# EAGLE schematic Typhoon-Mainboard (EAGLE 7.5.0)

## Sheet 1 of 5: Sheet1
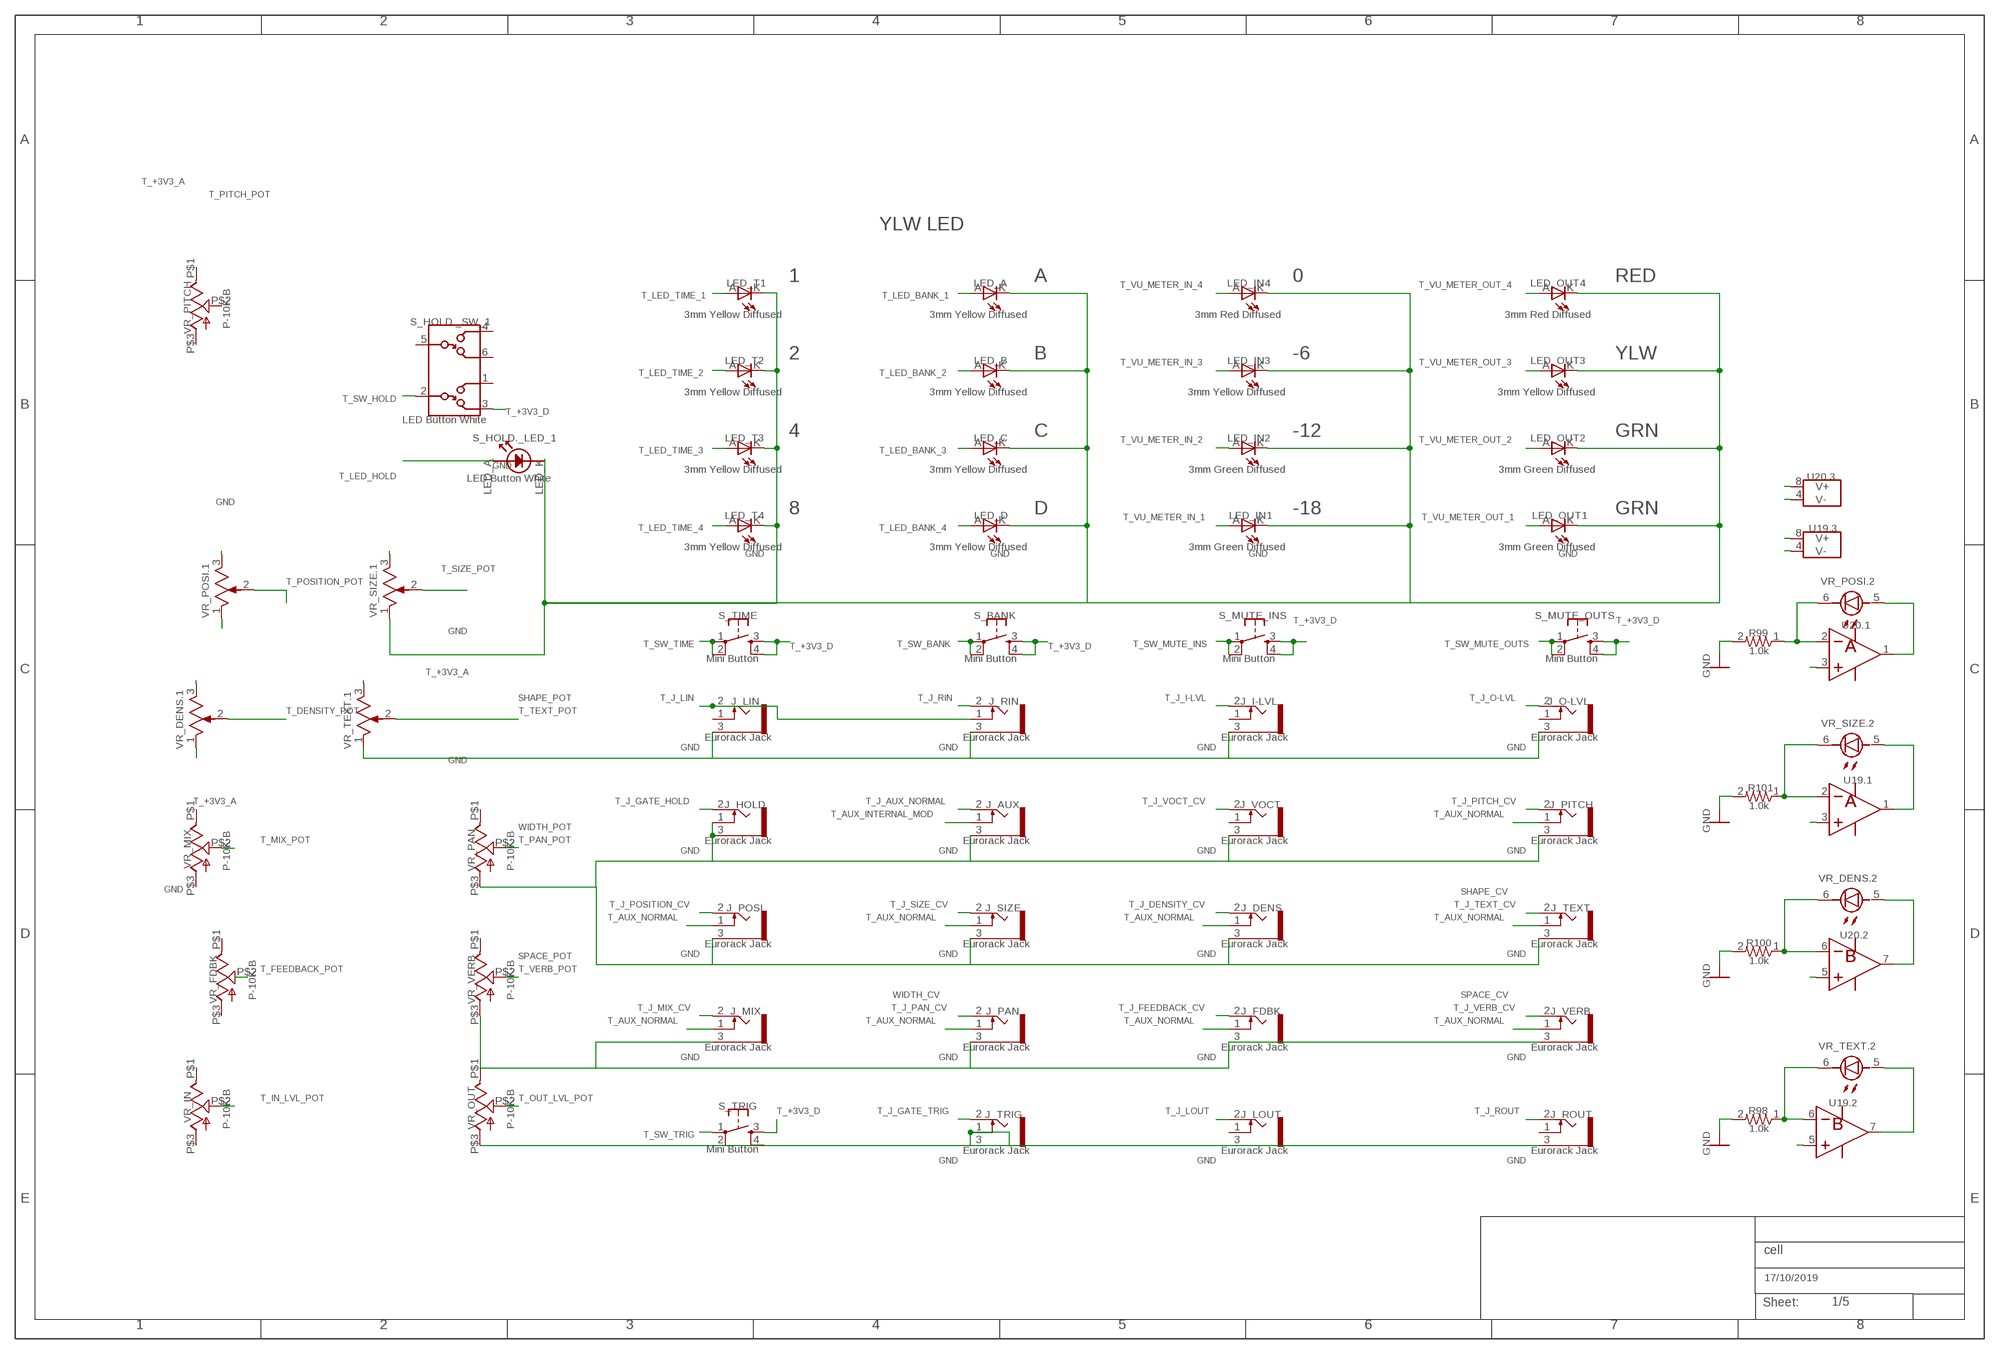
[diagram p0: schematic, sheet 1]

### Parts
J_AUX  Eurorack Jack  EURO_JACKS_SMALL_SILK_(EURO_JACK)  [THONKICONN]
J_DENS  Eurorack Jack  EURO_JACKS_SILK_(EURO_JACK)  [THONKICONN]
J_FDBK  Eurorack Jack  EURO_JACKS_SILK_(EURO_JACK)  [THONKICONN]
J_HOLD  Eurorack Jack  EURO_JACKS_SMALL_SILK_(EURO_JACK)  [THONKICONN]
J_I-LVL  Eurorack Jack  EURO_JACKS_SILK_(EURO_JACK)  [THONKICONN]
J_LIN  Eurorack Jack  EURO_JACKS_SILK_(EURO_JACK)  [THONKICONN]
J_LOUT  Eurorack Jack  EURO_JACKS_SILK_(EURO_JACK)  [THONKICONN]
J_MIX  Eurorack Jack  EURO_JACKS_SILK_(EURO_JACK)  [THONKICONN]
J_O-LVL  Eurorack Jack  EURO_JACKS_SILK_(EURO_JACK)  [THONKICONN]
J_PAN  Eurorack Jack  EURO_JACKS_SILK_(EURO_JACK)  [THONKICONN]
J_PITCH  Eurorack Jack  EURO_JACKS_SILK_(EURO_JACK)  [THONKICONN]
J_POSI  Eurorack Jack  EURO_JACKS_SILK_(EURO_JACK)  [THONKICONN]
J_RIN  Eurorack Jack  EURO_JACKS_SILK_(EURO_JACK)  [THONKICONN]
J_ROUT  Eurorack Jack  EURO_JACKS_SILK_(EURO_JACK)  [THONKICONN]
J_SIZE  Eurorack Jack  EURO_JACKS_SILK_(EURO_JACK)  [THONKICONN]
J_TEXT  Eurorack Jack  EURO_JACKS_SILK_(EURO_JACK)  [THONKICONN]
J_TRIG  Eurorack Jack  EURO_JACKS_SMALL_SILK_(EURO_JACK)  [THONKICONN]
J_VERB  Eurorack Jack  EURO_JACKS_SILK_(EURO_JACK)  [THONKICONN]
J_VOCT  Eurorack Jack  EURO_JACKS_SILK_(EURO_JACK)  [THONKICONN]
LED_A  3mm Yellow Diffused  LED_SILK_(LED)  [LED_SILK]
LED_B  3mm Yellow Diffused  LED_SILK_(LED)  [LED_SILK]
LED_C  3mm Yellow Diffused  LED_SILK_(LED)  [LED_SILK]
LED_D  3mm Yellow Diffused  LED_SILK_(LED)  [LED_SILK]
LED_IN1  3mm Green Diffused  LED_SILK_(LED)  [LED_SILK]
LED_IN2  3mm Green Diffused  LED_SILK_(LED)  [LED_SILK]
LED_IN3  3mm Yellow Diffused  LED_SILK_(LED)  [LED_SILK]
LED_IN4  3mm Red Diffused  LED_SILK_(LED)  [LED_SILK]
LED_OUT1  3mm Green Diffused  LED_SILK_(LED)  [LED_SILK]
LED_OUT2  3mm Green Diffused  LED_SILK_(LED)  [LED_SILK]
LED_OUT3  3mm Yellow Diffused  LED_SILK_(LED)  [LED_SILK]
LED_OUT4  3mm Red Diffused  LED_SILK_(LED)  [LED_SILK]
LED_T1  3mm Yellow Diffused  LED_SILK_(LED)  [LED_SILK]
LED_T2  3mm Yellow Diffused  LED_SILK_(LED)  [LED_SILK]
LED_T3  3mm Yellow Diffused  LED_SILK_(LED)  [LED_SILK]
LED_T4  3mm Yellow Diffused  LED_SILK_(LED)  [LED_SILK]
R98  1.0k  R-US_R0402_(R-US_)  [RES_0603]
R99  1.0k  R-US_R0402_(R-US_)  [RES_0603]
R100  1.0k  R-US_R0402_(R-US_)  [RES_0603]
R101  1.0k  R-US_R0402_(R-US_)  [RES_0603]
S_BANK  Mini Button  TAC_SWITCHTACTILE_PTH_SILK_(TAC_SWITCH)  [TACTILE-PTH_SILK]
S_HOLD  LED Button White  LED_BUTTONLED_BUTTON_SILK_(LED_BUTTON)  [LED_BUTTON_SILK]
S_MUTE_INS  Mini Button  TAC_SWITCHTACTILE_PTH_SILK_(TAC_SWITCH)  [TACTILE-PTH_SILK]
S_MUTE_OUTS  Mini Button  TAC_SWITCHTACTILE_PTH_SILK_(TAC_SWITCH)  [TACTILE-PTH_SILK]
S_TIME  Mini Button  TAC_SWITCHTACTILE_PTH_SILK_(TAC_SWITCH)  [TACTILE-PTH_SILK]
S_TRIG  Mini Button  TAC_SWITCHTACTILE_PTH_SILK_(TAC_SWITCH)  [TACTILE-PTH_SILK]
U19  TLV2172  [TSSOP-8]
U20  TLV2172  [TSSOP-8]
VR_DENS  BOURNS_PTL_LED_SLIDE_POT  [BOURNS_PTL_30MM]
VR_FDBK  P-10K-B  POT_9MM_SNAP-IN___(POT_9MM_SNAP-IN_)  [ALPS_POT_VERTICAL_PS]
VR_IN  P-10K-B  POT_9MM_SNAP-IN___(POT_9MM_SNAP-IN_)  [ALPS_POT_VERTICAL_PS]
VR_MIX  P-10K-B  POT_9MM_SNAP-IN___(POT_9MM_SNAP-IN_)  [ALPS_POT_VERTICAL_PS]
VR_OUT  P-10K-B  POT_9MM_SNAP-IN___(POT_9MM_SNAP-IN_)  [ALPS_POT_VERTICAL_PS]
VR_PAN  P-10K-B  POT_9MM_SNAP-IN___(POT_9MM_SNAP-IN_)  [ALPS_POT_VERTICAL_PS]
VR_PITCH  P-10K-B  POT_9MM_SNAP-IN___(POT_9MM_SNAP-IN_)  [ALPS_POT_VERTICAL_PS]
VR_POSI  BOURNS_PTL_LED_SLIDE_POT  [BOURNS_PTL_30MM]
VR_SIZE  BOURNS_PTL_LED_SLIDE_POT  [BOURNS_PTL_30MM]
VR_TEXT  BOURNS_PTL_LED_SLIDE_POT  [BOURNS_PTL_30MM]
VR_VERB  P-10K-B  POT_9MM_SNAP-IN___(POT_9MM_SNAP-IN_)  [ALPS_POT_VERTICAL_PS]

### Nets
+12V [power]: U19.8(PART_3:V+) U20.8(PART_3:V+) ; also sheet 2,3,4
-12V [power]: U19.4(PART_3:V-) U20.4(PART_3:V-) ; also sheet 2,3,4
GND: J_AUX.3(GND) J_DENS.3(GND) J_FDBK.3(GND) J_HOLD.1(NORM) J_HOLD.3(GND) J_I-LVL.3(GND) J_LIN.3(GND) J_LOUT.3(GND) J_MIX.3(GND) J_O-LVL.3(GND) J_PAN.3(GND) J_PITCH.3(GND) J_POSI.3(GND) J_RIN.3(GND) J_ROUT.3(GND) J_SIZE.3(GND) J_TEXT.3(GND) J_TRIG.1(NORM) J_TRIG.3(GND) J_VERB.3(GND) J_VOCT.3(GND) LED_A.K(C) LED_B.K(C) LED_C.K(C) LED_D.K(C) LED_IN1.K(C) LED_IN2.K(C) LED_IN3.K(C) LED_IN4.K(C) LED_OUT1.K(C) LED_OUT2.K(C) LED_OUT3.K(C) LED_OUT4.K(C) LED_T1.K(C) LED_T2.K(C) LED_T3.K(C) LED_T4.K(C) R98.2 R99.2 R100.2 R101.2 S_HOLD.LED_K(PART__LED_1:LED_K) VR_DENS.1(PART_1:CCW) VR_FDBK.P$3 VR_IN.P$3 VR_MIX.P$3 VR_OUT.P$3 VR_PAN.P$3 VR_PITCH.P$3 VR_POSI.1(PART_1:CCW) VR_SIZE.1(PART_1:CCW) VR_TEXT.1(PART_1:CCW) VR_VERB.P$3 ; supply symbol labelled GND_7 ; also sheet 2,3,4,5
Net_1: R99.1 U20.2(PART_1:IN-) VR_POSI.6(PART_2:gnd)
Net_109: R101.1 U19.2(PART_1:IN-) VR_SIZE.6(PART_2:gnd)
Net_110: R100.1 U20.6(PART_2:IN-) VR_DENS.6(PART_2:gnd)
Net_116: R98.1 U19.6(PART_2:IN-) VR_TEXT.6(PART_2:gnd)
Net_177: U20.1(PART_1:OUT) VR_POSI.5(PART_2:gnd)
Net_178: U19.1(PART_1:OUT) VR_SIZE.5(PART_2:gnd)
Net_182: U20.7(PART_2:OUT) VR_DENS.5(PART_2:gnd)
Net_183: U19.7(PART_2:OUT) VR_TEXT.5(PART_2:gnd)
T_+3V3_A [power]: VR_DENS.3(PART_1:CW) VR_FDBK.P$1 VR_MIX.P$1 VR_PAN.P$1 VR_PITCH.P$1 VR_POSI.3(PART_1:CW) VR_SIZE.3(PART_1:CW) VR_TEXT.3(PART_1:CW) VR_VERB.P$1 ; also sheet 2,4,5
T_+3V3_D [power]: S_BANK.3 S_BANK.4 S_HOLD.3 S_MUTE_INS.3 S_MUTE_INS.4 S_MUTE_OUTS.3 S_MUTE_OUTS.4 S_TIME.3 S_TIME.4 S_TRIG.3 ; also sheet 2,4,5
T_+10V: VR_IN.P$1 VR_OUT.P$1 ; also sheet 2
T_AUX_INTERNAL_MOD: J_AUX.1(NORM) ; also sheet 4
T_AUX_NORMAL: J_DENS.1(NORM) J_FDBK.1(NORM) J_MIX.1(NORM) J_PAN.1(NORM) J_PITCH.1(NORM) J_POSI.1(NORM) J_SIZE.1(NORM) J_TEXT.1(NORM) J_VERB.1(NORM) ; also sheet 4
T_DENSITY_POT: VR_DENS.2(PART_1:W) ; also sheet 5
T_FEEDBACK_POT: VR_FDBK.P$2 ; also sheet 5
T_IN_LVL_POT: VR_IN.P$2 ; also sheet 3
T_J_AUX_NORMAL: J_AUX.2(TIP) ; also sheet 4
T_J_DENSITY_CV: J_DENS.2(TIP) U20.5(PART_2:IN+) ; also sheet 4
T_J_FEEDBACK_CV: J_FDBK.2(TIP) ; also sheet 4
T_J_GATE_HOLD: J_HOLD.2(TIP) ; also sheet 4
T_J_GATE_TRIG: J_TRIG.2(TIP) ; also sheet 4
T_J_I-LVL: J_I-LVL.2(TIP) ; also sheet 3
T_J_LIN: J_LIN.2(TIP) J_RIN.1(NORM) ; also sheet 3
T_J_LOUT: J_LOUT.2(TIP) ; also sheet 3
T_J_MIX_CV: J_MIX.2(TIP) ; also sheet 4
T_J_O-LVL: J_O-LVL.2(TIP) ; also sheet 3
T_J_PAN_CV: J_PAN.2(TIP) ; also sheet 4
T_J_PITCH_CV: J_PITCH.2(TIP) ; also sheet 4
T_J_POSITION_CV: J_POSI.2(TIP) U20.3(PART_1:IN+) ; also sheet 4
T_J_RIN: J_RIN.2(TIP) ; also sheet 3
T_J_ROUT: J_ROUT.2(TIP) ; also sheet 3
T_J_SIZE_CV: J_SIZE.2(TIP) U19.3(PART_1:IN+) ; also sheet 4
T_J_TEXT_CV: J_TEXT.2(TIP) U19.5(PART_2:IN+) ; also sheet 4
T_J_VERB_CV: J_VERB.2(TIP) ; also sheet 4
T_J_VOCT_CV: J_VOCT.2(TIP) ; also sheet 4
T_LED_BANK_1: LED_A.A ; also sheet 5
T_LED_BANK_2: LED_B.A ; also sheet 5
T_LED_BANK_3: LED_C.A ; also sheet 5
T_LED_BANK_4: LED_D.A ; also sheet 5
T_LED_HOLD: S_HOLD.LED_A(PART__LED_1:LED_A) ; also sheet 5
T_LED_TIME_1: LED_T1.A ; also sheet 5
T_LED_TIME_2: LED_T2.A ; also sheet 5
T_LED_TIME_3: LED_T3.A ; also sheet 5
T_LED_TIME_4: LED_T4.A ; also sheet 5
T_MIX_POT: VR_MIX.P$2 ; also sheet 5
T_OUT_LVL_POT: VR_OUT.P$2 ; also sheet 3
T_PAN_POT: VR_PAN.P$2 ; also sheet 5
T_PITCH_POT: VR_PITCH.P$2 ; also sheet 5
T_POSITION_POT: VR_POSI.2(PART_1:W) ; also sheet 5
T_SIZE_POT: VR_SIZE.2(PART_1:W) ; also sheet 5
T_SW_BANK: S_BANK.1 S_BANK.2 ; also sheet 5
T_SW_HOLD: S_HOLD.2 ; also sheet 5
T_SW_MUTE_INS: S_MUTE_INS.1 S_MUTE_INS.2 ; also sheet 5
T_SW_MUTE_OUTS: S_MUTE_OUTS.1 S_MUTE_OUTS.2 ; also sheet 5
T_SW_TIME [power]: S_TIME.1 S_TIME.2 ; also sheet 5
T_SW_TRIG: S_TRIG.1 ; also sheet 5
T_TEXT_POT: VR_TEXT.2(PART_1:W) ; also sheet 5
T_VERB_POT: VR_VERB.P$2 ; also sheet 5
T_VU_METER_IN_1: LED_IN1.A ; also sheet 5
T_VU_METER_IN_2: LED_IN2.A ; also sheet 5
T_VU_METER_IN_3: LED_IN3.A ; also sheet 5
T_VU_METER_IN_4: LED_IN4.A ; also sheet 5
T_VU_METER_OUT_1: LED_OUT1.A ; also sheet 5
T_VU_METER_OUT_2: LED_OUT2.A ; also sheet 5
T_VU_METER_OUT_3: LED_OUT3.A ; also sheet 5
T_VU_METER_OUT_4: LED_OUT4.A ; also sheet 5
Unconnected: J_I-LVL.1(NORM) J_LIN.1(NORM) J_LOUT.1(NORM) J_O-LVL.1(NORM) J_ROUT.1(NORM) J_VOCT.1(NORM) S_HOLD.1 S_HOLD.4 S_HOLD.5 S_HOLD.6 S_TRIG.2 S_TRIG.4

### Notes on the sheet
- 1 | 2 | 3 | 4 | 5 | 6 | 7 | 8
- A | A
- T_+3V3_A
- T_PITCH_POT
- YLW LED
- 1 | A | 0 | RED
- T_VU_METER_IN_4 | T_VU_METER_OUT_4
- LED_T1 | LED_A | LED_IN4 | LED_OUT4
- T_LED_TIME_1 | T_LED_BANK_1
- 3mm Yellow Diffused | 3mm Yellow Diffused | 3mm Red Diffused | 3mm Red Diffused
- S_HOLD._SW_1
- P-10K-B
- VR_PITCH
- 2 | B | -6 | YLW
- T_VU_METER_IN_3 | T_VU_METER_OUT_3
- LED_T2 | LED_B | LED_IN3 | LED_OUT3
- T_LED_TIME_2 | T_LED_BANK_2
- 3mm Yellow Diffused | 3mm Yellow Diffused | 3mm Yellow Diffused | 3mm Yellow Diffused
- T_SW_HOLD
- B | B
- T_+3V3_D
- LED Button White
- 4 | C | -12 | GRN
- T_VU_METER_IN_2 | T_VU_METER_OUT_2
- S_HOLD._LED_1 | LED_T3 | LED_C | LED_IN2 | LED_OUT2
- T_LED_TIME_3 | T_LED_BANK_3
- GND
- 3mm Yellow Diffused | 3mm Yellow Diffused | 3mm Green Diffused | 3mm Green Diffused
- T_LED_HOLD | LED Button White
- U20.3
- GND | 8 | D | -18 | GRN
- T_VU_METER_IN_1 | T_VU_METER_OUT_1
- LED_T4 | LED_D | LED_IN1 | LED_OUT1
- T_LED_TIME_4 | T_LED_BANK_4
- U19.3
- 3mm Yellow Diffused | 3mm Yellow Diffused | 3mm Green Diffused | 3mm Green Diffused
- GND | GND | GND | GND
- T_SIZE_POT
- T_POSITION_POT
- VR_POSI.2
- VR_POSI.1 | VR_SIZE.1 | S_TIME | S_BANK | S_MUTE_INS | T_+3V3_D | S_MUTE_OUTS | T_+3V3_D
- GND | U20.1
- R99
- T_SW_TIME | T_SW_BANK | T_SW_MUTE_INS | T_SW_MUTE_OUTS | A
- T_+3V3_D | T_+3V3_D
- 1.0k
- Mini Button | Mini Button | Mini Button | Mini Button
- C | C
- T_+3V3_A
- GND
- SHAPE_POT | T_J_LIN | T_J_RIN | T_J_I-LVL | T_J_O-LVL
- J_LIN | J_RIN | J_I-LVL | J_O-LVL
- T_DENSITY_POT | T_TEXT_POT
- VR_SIZE.2
- Eurorack Jack | Eurorack Jack | Eurorack Jack | Eurorack Jack
- GND | GND | GND | GND
- VR_DENS.1 | VR_TEXT.1
- GND
- U19.1
- R101
- A
- T_+3V3_A | T_J_GATE_HOLD | T_J_AUX_NORMAL | T_J_VOCT_CV | T_J_PITCH_CV
- 1.0k
- J_HOLD | J_AUX | J_VOCT | J_PITCH
- T_AUX_INTERNAL_MOD | T_AUX_NORMAL
- WIDTH_POT
- GND
- T_MIX_POT | T_PAN_POT | Eurorack Jack | Eurorack Jack | Eurorack Jack | Eurorack Jack
- GND | GND | GND | GND
- VR_MIX | P-10K-B | VR_PAN | P-10K-B
- VR_DENS.2
- GND | SHAPE_CV
- T_J_POSITION_CV | T_J_SIZE_CV | T_J_DENSITY_CV | T_J_TEXT_CV
- J_POSI | J_SIZE | J_DENS | J_TEXT
- T_AUX_NORMAL | T_AUX_NORMAL | T_AUX_NORMAL | T_AUX_NORMAL
- D | D
- Eurorack Jack | Eurorack Jack | Eurorack Jack | Eurorack Jack | U20.2
- R100
- GND | GND | GND | GND | B
- SPACE_POT
- 1.0k
- T_FEEDBACK_POT | T_VERB_POT
- GND
- WIDTH_CV | SPACE_CV
- P-10K-B | P-10K-B
- VR_FDBK | VR_VERB | T_J_MIX_CV | T_J_PAN_CV | T_J_FEEDBACK_CV | T_J_VERB_CV
- J_MIX | J_PAN | J_FDBK | J_VERB
- T_AUX_NORMAL | T_AUX_NORMAL | T_AUX_NORMAL | T_AUX_NORMAL
- Eurorack Jack | Eurorack Jack | Eurorack Jack | Eurorack Jack
- VR_TEXT.2
- GND | GND | GND | GND
- T_IN_LVL_POT | T_OUT_LVL_POT
- T_+3V3_D | T_J_GATE_TRIG | T_J_LOUT | T_J_ROUT | U19.2
- S_TRIG
- R98
- J_TRIG | J_LOUT | J_ROUT | B
- VR_IN | 1.0k
- P-10K-B | VR_OUT | P-10K-B
- T_SW_TRIG
- Mini Button | Eurorack Jack | Eurorack Jack | Eurorack Jack
- GND | GND | GND | GND
- E | E
- cell
- 17/10/2019
- Sheet: | 1/5
- 1 | 2 | 3 | 4 | 5 | 6 | 7 | 8

## Sheet 2 of 5: Sheet2
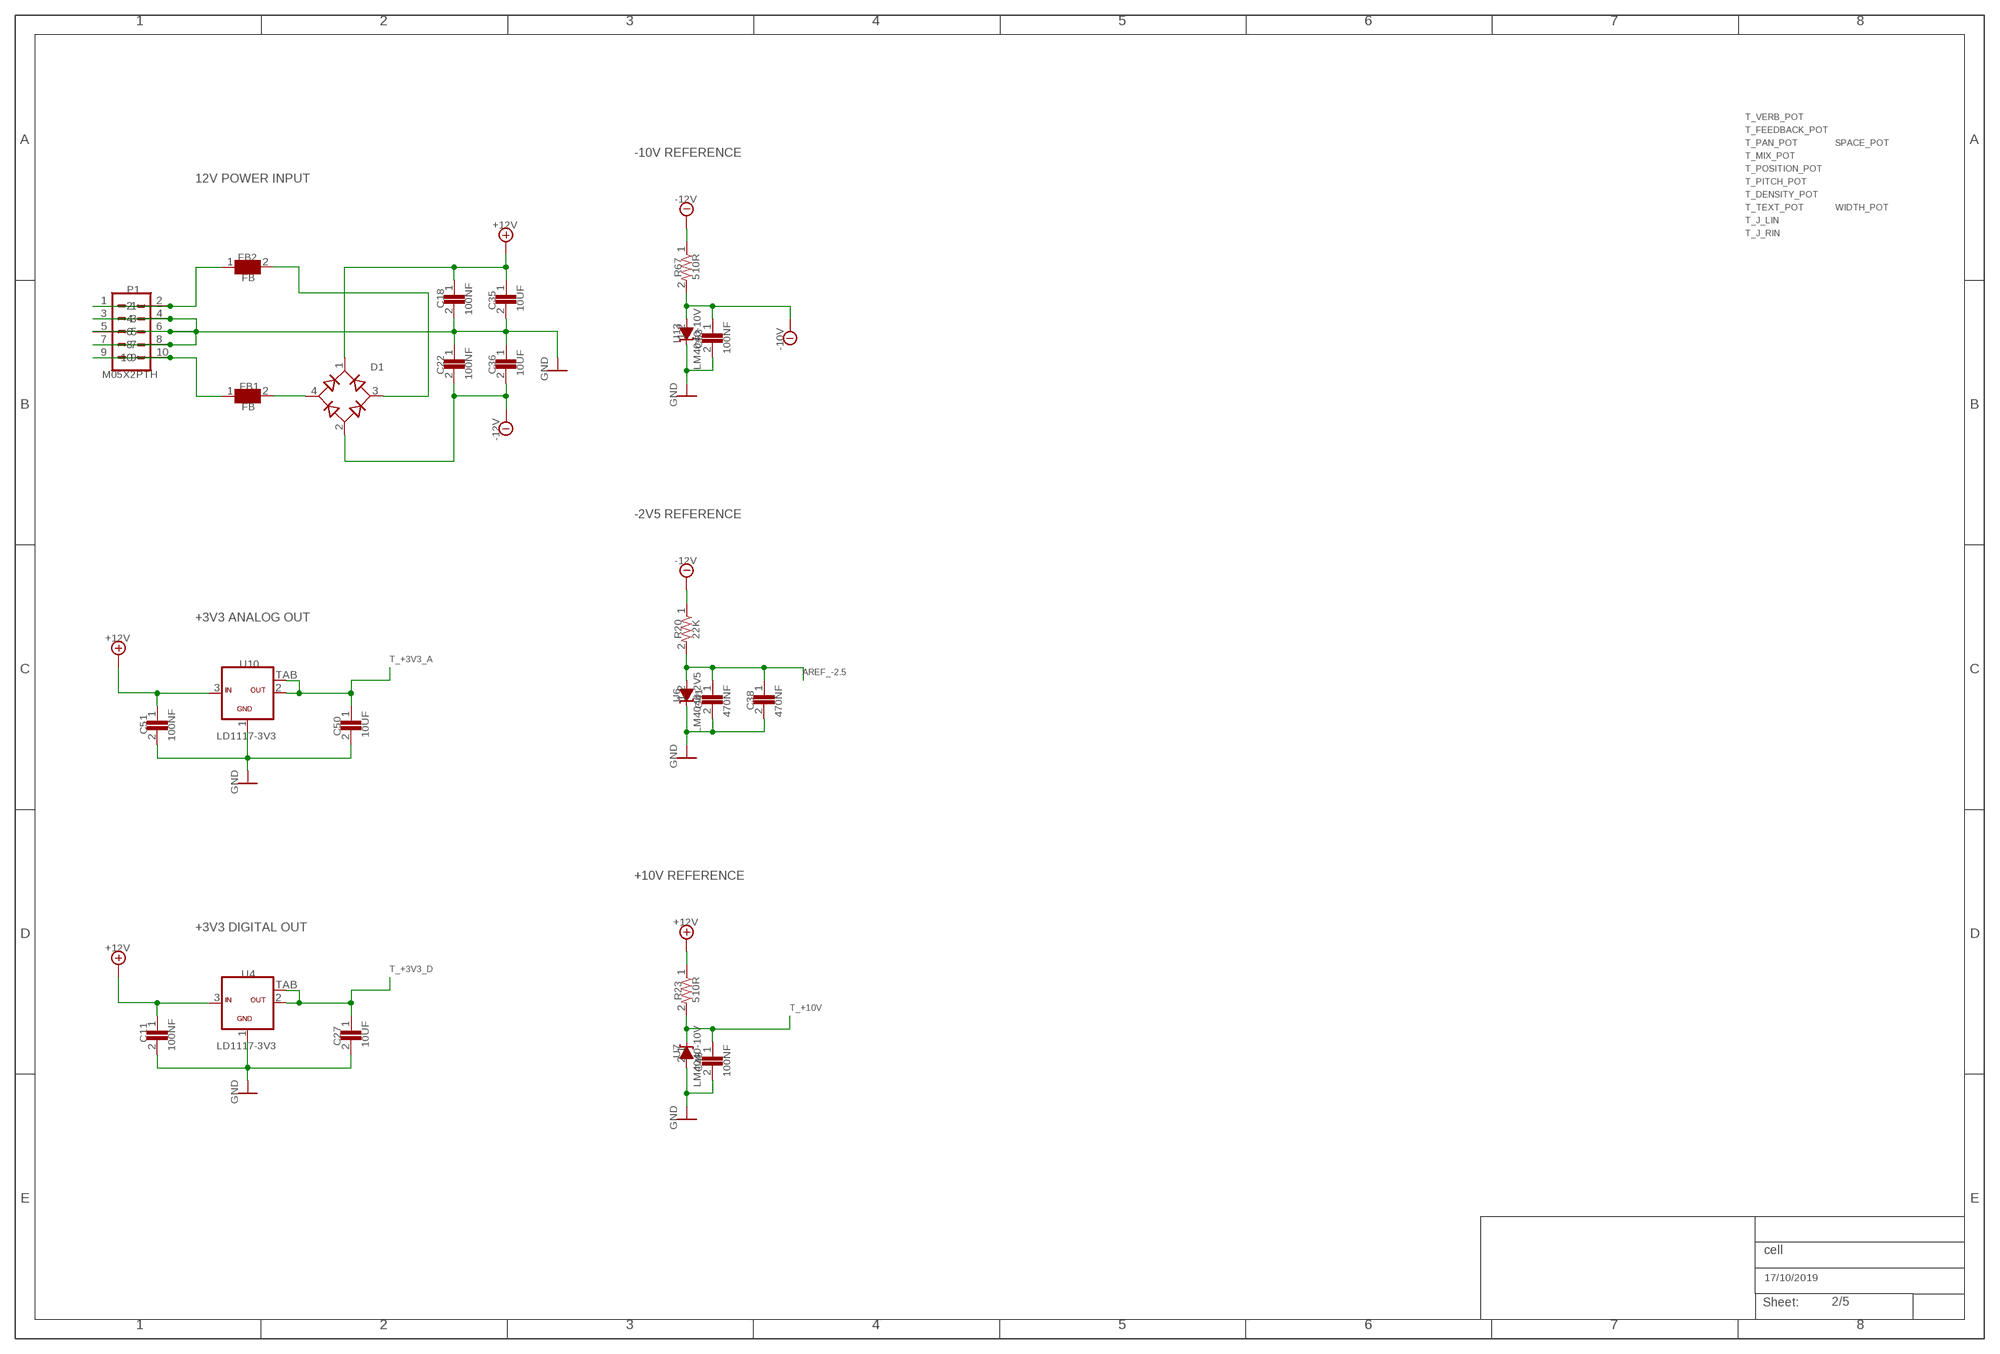
[diagram p1: schematic, sheet 2]

### Parts
C11  100NF  C-EUC0603_(C-EU)  [CAP_0603]
C18  100NF  C-EUC0603_(C-EU)  [CAP_0603]
C22  100NF  C-EUC0603_(C-EU)  [CAP_0603]
C27  10UF  C-EUC0805_(C-EU)  [C0805]
C35  10UF  C-EUC0805_(C-EU)  [C0805]
C36  10UF  C-EUC0805_(C-EU)  [C0805]
C38  470NF  C-EUC0603_(C-EU)  [CAP_0603]
C41  470NF  C-EUC0603_(C-EU)  [CAP_0603]
C48  100NF  C-EUC0603_(C-EU)  [CAP_0603]
C50  10UF  C-EUC0805_(C-EU)  [C0805]
C51  100NF  C-EUC0603_(C-EU)  [CAP_0603]
C63  100NF  C-EUC0603_(C-EU)  [CAP_0603]
D1  MB1S  [SOP-4/6.5X2.54]
FB1  FB  FERRITE_BEAD_0603_(FERRITE_BEAD)  [WUERTH-ELEKTRONIK_0603]
FB2  FB  FERRITE_BEAD_0603_(FERRITE_BEAD)  [WUERTH-ELEKTRONIK_0603]
P1  M05X2PTH  [AVR_ICSP]
R20  22K  R-US_R0603_(R-US_)  [RES_0603]
R23  510R  R-US_R0603_(R-US_)  [RES_0603]
R67  510R  R-US_R0603_(R-US_)  [RES_0603]
U4  LD1117-3V3  LD1117-3V3_(LD1117)  [SOT223]
U6  LM4040-2V5  LM4041DBZA12_(LM4041)  [DBZ_R-PDSO-G3]
U7  LM4040-10V  LM4041DBZA12_(LM4041)_14  [DBZ_R-PDSO-G3]
U10  LD1117-3V3  LD1117-3V3_(LD1117)  [SOT223]
U13  LM4040-10V  LM4041DBZA12_(LM4041)  [DBZ_R-PDSO-G3]

### Nets
+12V [power]: C11.1 C18.1 C35.1 C51.1 D1.1(+) R23.1 U4.3(IN) U10.3(IN) ; also sheet 1,3,4
-10V: C63.1 R67.2 U13.2(A) ; supply symbol labelled -10V_28 ; also sheet 4
-12V [power]: C22.2 C36.2 D1.2(-) R20.1 R67.1 ; supply symbol labelled -12V_11 ; also sheet 1,3,4
AREF_-2.5: C38.1 C41.1 R20.2 U6.2(A) ; also sheet 3
GND: C11.2 C18.2 C22.1 C27.2 C35.2 C36.1 C38.2 C41.2 C48.2 C50.2 C51.2 C63.2 P1.3 P1.4 P1.5 P1.6 P1.7 P1.8 U4.1(GND) U6.1(C) U7.2(A) U10.1(GND) U13.1(C) ; supply symbol labelled GND_7 ; also sheet 1,3,4,5
N$2 [power]: FB2.1 P1.1 P1.2
N$6: FB1.1 P1.9 P1.10
Net_38 [power]: D1.4(AC1) FB1.2
Net_40 [power]: D1.3(AC2) FB2.2
T_+3V3_A [power]: C50.1 U10.2(OUT) U10.TAB(OUT1) ; also sheet 1,4,5
T_+3V3_D [power]: C27.1 U4.2(OUT) U4.TAB(OUT1) ; also sheet 1,4,5
T_+10V: C48.1 R23.2 U7.1(C) ; also sheet 1

### Notes on the sheet
- 1 | 2 | 3 | 4 | 5 | 6 | 7 | 8
- T_VERB_POT
- T_FEEDBACK_POT
- A | A
- T_PAN_POT | SPACE_POT
- -10V REFERENCE
- T_MIX_POT
- T_POSITION_POT
- 12V POWER INPUT
- T_PITCH_POT
- T_DENSITY_POT
- -12V | T_TEXT_POT | WIDTH_POT
- T_J_LIN
- +12V | T_J_RIN
- FB2
- FB
- R67 | 510R
- P1
- C18 | C35
- 10UF
- 100NF
- U13
- C63 | -10V
- 100NF
- M05X2PTH | D1 | LM4040-10V
- C22 | C36 | 10UF
- 100NF | GND
- FB1
- B | B
- FB
- GND
- -12V
- -2V5 REFERENCE
- -12V
- +3V3 ANALOG OUT
- +12V | R20 | 22K
- T_+3V3_A
- C | C
- U10 | AREF_-2.5
- IN | OUT
- U6
- GND
- C41 | C38
- 470NF | 470NF
- C51 | LD1117-3V3 | LM4040-2V5
- C50 | 10UF
- 100NF
- GND
- GND
- +10V REFERENCE
- +3V3 DIGITAL OUT | +12V
- D | D
- +12V
- T_+3V3_D
- U4
- IN | OUT
- R23 | 510R
- T_+10V
- GND
- C11 | LD1117-3V3
- C27 | 10UF
- 100NF
- U7
- C48
- 100NF
- LM4040-10V
- GND
- GND
- E | E
- cell
- 17/10/2019
- Sheet: | 2/5
- 1 | 2 | 3 | 4 | 5 | 6 | 7 | 8

## Sheet 3 of 5: Sheet3
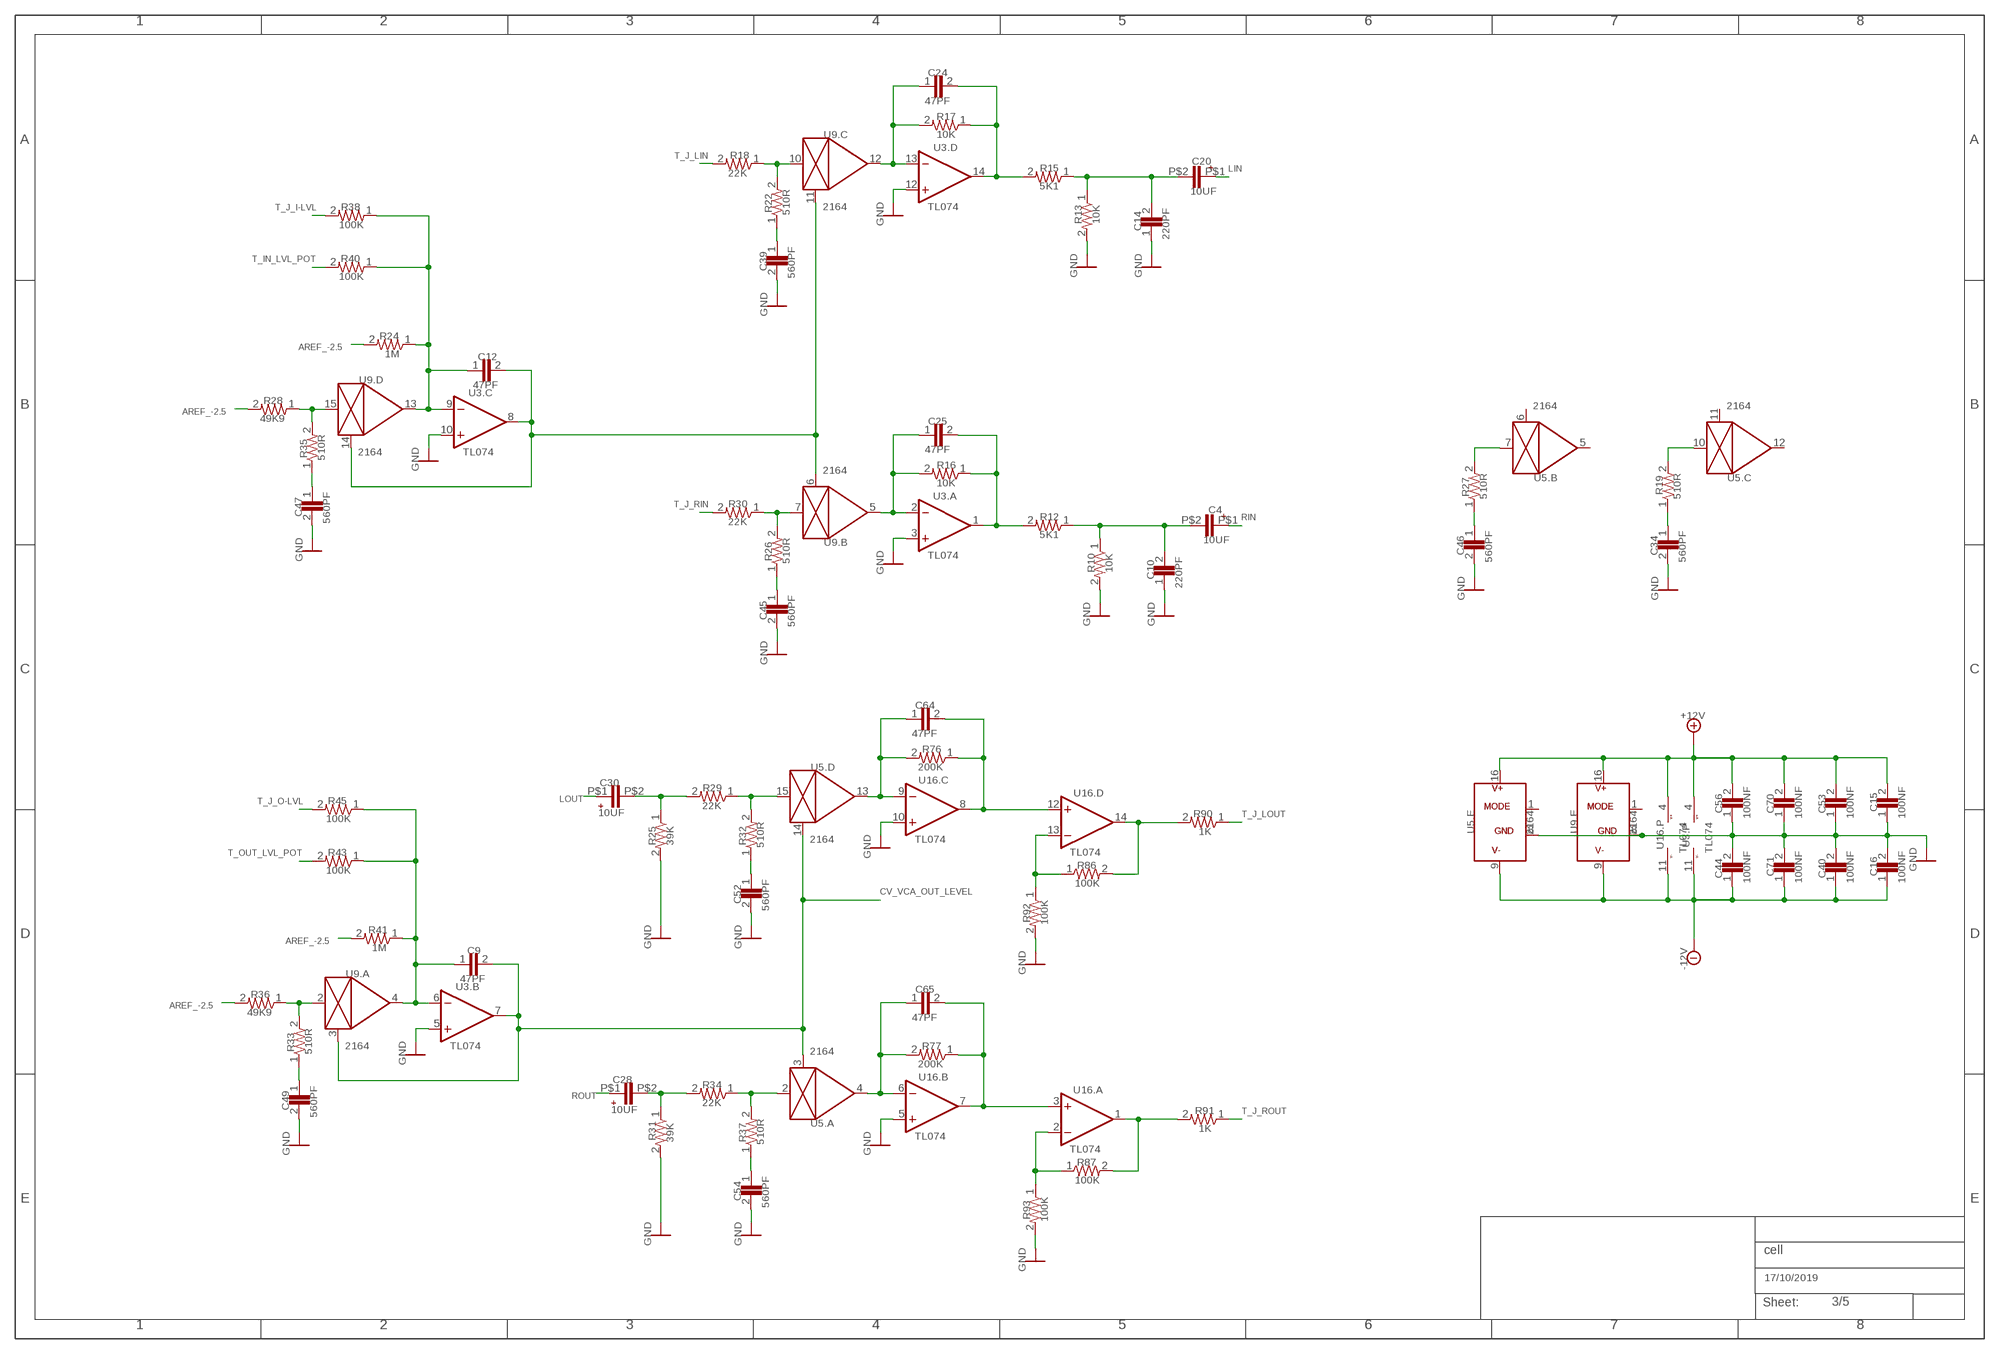
[diagram p2: schematic, sheet 3]

### Parts
C4  10UF  C-EU-POL_4D_(C-EU-POL)  [EC-4X7]
C9  47PF  C-EUC0603_(C-EU)  [CAP_0603]
C10  220PF  C-EUC0603_(C-EU)  [CAP_0603]
C12  47PF  C-EUC0603_(C-EU)  [CAP_0603]
C14  220PF  C-EUC0603_(C-EU)  [CAP_0603]
C15  100NF  C-EUC0603_(C-EU)  [CAP_0603]
C16  100NF  C-EUC0603_(C-EU)  [CAP_0603]
C20  10UF  C-EU-POL_4D_(C-EU-POL)  [EC-4X7]
C24  47PF  C-EUC0603_(C-EU)  [CAP_0603]
C25  47PF  C-EUC0603_(C-EU)  [CAP_0603]
C28  10UF  C-EU-POL_4D_(C-EU-POL)  [EC-4X7]
C30  10UF  C-EU-POL_4D_(C-EU-POL)  [EC-4X7]
C34  560PF  C-EUC0603_(C-EU)  [CAP_0603]
C39  560PF  C-EUC0603_(C-EU)  [CAP_0603]
C40  100NF  C-EUC0603_(C-EU)  [CAP_0603]
C44  100NF  C-EUC0603_(C-EU)  [CAP_0603]
C45  560PF  C-EUC0603_(C-EU)  [CAP_0603]
C46  560PF  C-EUC0603_(C-EU)  [CAP_0603]
C47  560PF  C-EUC0603_(C-EU)  [CAP_0603]
C49  560PF  C-EUC0603_(C-EU)  [CAP_0603]
C52  560PF  C-EUC0603_(C-EU)  [CAP_0603]
C53  100NF  C-EUC0603_(C-EU)  [CAP_0603]
C54  560PF  C-EUC0603_(C-EU)  [CAP_0603]
C56  100NF  C-EUC0603_(C-EU)  [CAP_0603]
C64  47PF  C-EUC0603_(C-EU)  [CAP_0603]
C65  47PF  C-EUC0603_(C-EU)  [CAP_0603]
C70  100NF  C-EUC0603_(C-EU)  [CAP_0603]
C71  100NF  C-EUC0603_(C-EU)  [CAP_0603]
R10  10K  R-US_R0603_(R-US_)  [RES_0603]
R12  5K1  R-US_R0603_(R-US_)  [RES_0603]
R13  10K  R-US_R0603_(R-US_)  [RES_0603]
R15  5K1  R-US_R0603_(R-US_)  [RES_0603]
R16  10K  R-US_R0603_(R-US_)  [RES_0603]
R17  10K  R-US_R0603_(R-US_)  [RES_0603]
R18  22K  R-US_R0603_(R-US_)  [RES_0603]
R19  510R  R-US_R0603_(R-US_)  [RES_0603]
R22  510R  R-US_R0603_(R-US_)  [RES_0603]
R24  1M  R-US_R0603_(R-US_)  [RES_0603]
R25  39K  R-US_R0603_(R-US_)  [RES_0603]
R26  510R  R-US_R0603_(R-US_)  [RES_0603]
R27  510R  R-US_R0603_(R-US_)  [RES_0603]
R28  49K9  R-US_R0603_(R-US_)  [RES_0603]
R29  22K  R-US_R0603_(R-US_)  [RES_0603]
R30  22K  R-US_R0603_(R-US_)  [RES_0603]
R31  39K  R-US_R0603_(R-US_)  [RES_0603]
R32  510R  R-US_R0603_(R-US_)  [RES_0603]
R33  510R  R-US_R0603_(R-US_)  [RES_0603]
R34  22K  R-US_R0603_(R-US_)  [RES_0603]
R35  510R  R-US_R0603_(R-US_)  [RES_0603]
R36  49K9  R-US_R0603_(R-US_)  [RES_0603]
R37  510R  R-US_R0603_(R-US_)  [RES_0603]
R38  100K  R-US_R0603_(R-US_)  [RES_0603]
R40  100K  R-US_R0603_(R-US_)  [RES_0603]
R41  1M  R-US_R0603_(R-US_)  [RES_0603]
R43  100K  R-US_R0603_(R-US_)  [RES_0603]
R45  100K  R-US_R0603_(R-US_)  [RES_0603]
R76  200K  R-US_R0603_(R-US_)  [RES_0603]
R77  200K  R-US_R0603_(R-US_)  [RES_0603]
R86  100K  R-US_R0603_(R-US_)  [RES_0603]
R87  100K  R-US_R0603_(R-US_)  [RES_0603]
R90  1K  R-US_R0603_(R-US_)  [RES_0603]
R91  1K  R-US_R0603_(R-US_)  [RES_0603]
R92  100K  R-US_R0603_(R-US_)  [RES_0603]
R93  100K  R-US_R0603_(R-US_)  [RES_0603]
U3  TL074  TL074_SO-14_(TL074)  [SO-14]
U5  2164  SSI2164  [SO-16]
U9  2164  SSI2164_40  [SO-16]
U16  TL074  TL074_SO-14_(TL074)_4  [SO-14]

### Nets
+12V [power]: C15.2 C53.2 C56.2 C70.2 U3.4(PART_P:V+) U5.16(PART_E:V+) U9.16(PART_E:V+) U16.4(PART_P:V+) ; also sheet 1,2,4
-12V [power]: C16.1 C40.1 C44.1 C71.1 U3.11(PART_P:V-) U5.9(PART_E:V-) U9.9(PART_E:V-) U16.11(PART_P:V-) ; also sheet 1,2,4
AREF_-2.5: R24.2 R28.2 R36.2 R41.2 ; also sheet 2
CV_VCA_OUT_LEVEL: C9.2 U3.7(PART_B:OUT) U5.3(PART_A:CTRL) U5.14(PART_D:CTRL) U9.3(PART_A:CTRL) ; also sheet 5
GND: C10.1 C14.1 C15.1 C16.2 C34.2 C39.2 C40.2 C44.2 C45.2 C46.2 C47.2 C49.2 C52.2 C53.1 C54.2 C56.1 C70.1 C71.2 R10.2 R13.2 R25.2 R31.2 R92.2 R93.2 U3.3(PART_A:+IN) U3.5(PART_B:+IN) U3.10(PART_C:+IN) U3.12(PART_D:+IN) U5.8(PART_E:GND) U9.8(PART_E:GND) U16.5(PART_B:+IN) U16.10(PART_C:+IN) ; supply symbol labelled GND_7 ; also sheet 1,2,4,5
LIN: C20.P$1(POS) ; also sheet 5
LOUT: C30.P$1(POS) ; also sheet 5
N$50: C39.1 R22.1
N$51: C45.1 R26.1
N$54: C47.1 R35.1
N$55: C12.2 U3.8(PART_C:OUT) U9.6(PART_B:CTRL) U9.11(PART_C:CTRL) U9.14(PART_D:CTRL)
N$56: R26.2 R30.1 U9.7(PART_B:IN)
N$57: R28.1 R35.2 U9.15(PART_D:IN)
N$58: C25.1 R16.2 U3.2(PART_A:-IN) U9.5(PART_B:OUT)
N$61: C25.2 R12.2 R16.1 U3.1(PART_A:OUT)
N$67: C49.1 R33.1
N$70: R33.2 R36.1 U9.2(PART_A:IN)
N$73: C64.1 R76.2 U5.13(PART_D:OUT) U16.9(PART_C:-IN)
N$74: C64.2 R76.1 U16.8(PART_C:OUT) U16.12(PART_D:+IN)
N$75: R18.1 R22.2 U9.10(PART_C:IN)
N$76: R27.2 U5.7(PART_B:IN)
N$78: R29.1 R32.2 U5.15(PART_D:IN)
N$79: C52.1 R32.1
N$80: C30.P$2(NEG) R25.1 R29.2
N$83: C4.P$2(NEG) C10.2 R10.1 R12.1
N$86: C65.1 R77.2 U5.4(PART_A:OUT) U16.6(PART_B:-IN)
N$87: C65.2 R77.1 U16.3(PART_A:+IN) U16.7(PART_B:OUT)
N$89: R34.1 R37.2 U5.2(PART_A:IN)
N$90: C54.1 R37.1
N$91: C28.P$2(NEG) R31.1 R34.2
N$92: R19.2 U5.10(PART_C:IN)
N$96: C24.1 R17.2 U3.13(PART_D:-IN) U9.12(PART_C:OUT)
N$100: C24.2 R15.2 R17.1 U3.14(PART_D:OUT)
N$115: R86.1 R92.1 U16.13(PART_D:-IN)
N$117: C46.1 R27.1
N$118: C34.1 R19.1
N$119: R86.2 R90.2 U16.14(PART_D:OUT)
N$120: R87.1 R93.1 U16.2(PART_A:-IN)
N$121: R87.2 R91.2 U16.1(PART_A:OUT)
N$125: C14.2 C20.P$2(NEG) R13.1 R15.1
RIN: C4.P$1(POS) ; also sheet 5
ROUT: C28.P$1(POS) ; also sheet 5
T_IN_LVL_POT: R40.2 ; also sheet 1
T_J_I-LVL: R38.2 ; also sheet 1
T_J_LIN: R18.2 ; also sheet 1
T_J_LOUT: R90.1 ; also sheet 1
T_J_O-LVL: R45.2 ; also sheet 1
T_J_RIN: R30.2 ; also sheet 1
T_J_ROUT: R91.1 ; also sheet 1
T_OUT_LVL_POT: R43.2 ; also sheet 1
VCA_CTRL_INPUTS: C12.1 R24.1 R38.1 R40.1 U3.9(PART_C:-IN) U9.13(PART_D:OUT)
VCA_CTRL_INPUTS1: C9.1 R41.1 R43.1 R45.1 U3.6(PART_B:-IN) U9.4(PART_A:OUT)
Unconnected: U5.1(PART_E:MODE) U5.5(PART_B:OUT) U5.6(PART_B:CTRL) U5.11(PART_C:CTRL) U5.12(PART_C:OUT) U9.1(PART_E:MODE)

### Notes on the sheet
- 1 | 2 | 3 | 4 | 5 | 6 | 7 | 8
- C24
- 47PF
- R17
- 10K
- A | A
- U9.C
- T_J_LIN | U3.D
- R18
- C20 | + | LIN
- 22K | R15
- 5K1
- 10UF
- T_J_I-LVL | 2164 | TL074
- R38 | R22
- 510R
- 100K
- GND | R13 | 10K
- C14
- 220PF
- T_IN_LVL_POT
- R40
- 100K | C39
- 560PF | GND | GND
- GND
- R24
- AREF_-2.5
- 1M
- C12
- U9.D | 47PF
- B | U3.C | B
- R28
- AREF_-2.5 | 2164 | 2164
- 49K9
- C25
- 2164 | TL074 | 47PF
- R35 | 510R
- GND | R16
- 2164 | U5.B | U5.C
- 10K
- R27 | R19
- T_J_RIN | U3.A | 510R | 510R
- R30
- C4 | + | RIN
- C47 | 22K
- R12
- 560PF
- 5K1
- U9.B | 10UF
- TL074
- C46 | C34
- GND | R26 | 510R | 560PF | 560PF
- GND | R10 | 10K
- C10
- 220PF
- GND | GND
- C45
- 560PF | GND | GND
- C | GND | C
- C64
- +12V
- 47PF
- R76
- 200K
- U5.D
- C30 | U16.C | V+ | V+
- R29
- T_J_O-LVL | LOUT | U16.D
- R45 | 22K | MODE | MODE
- 10UF | +
- T_J_LOUT | C56 | C70 | C53 | C15
- 100K | R90
- V+ | V+ | 100NF | 100NF | 100NF | 100NF
- 1K | GND | GND
- 2164 | TL074 | U5.E | 2164 | U9.E | 2164
- R25 | 39K | R32 | 510R | TL074 | V- | V- | U3.P
- T_OUT_LVL_POT | U16.P
- R43 | TL074 | TL074
- GND | V- | V-
- 100K | R86
- GND
- C44 | C71 | C40 | C16
- 100K
- 100NF | 100NF | 100NF | 100NF
- CV_VCA_OUT_LEVEL
- C52
- 560PF
- R92 | 100K
- D | D
- R41
- AREF_-2.5
- 1M
- GND | GND
- C9
- -12V
- U9.A | 47PF | GND
- U3.B | C65
- R36
- AREF_-2.5
- 49K9
- 47PF
- 2164 | TL074
- R33 | R77
- 510R | 2164
- 200K
- GND
- C28 | U16.B
- R34
- ROUT | U16.A
- 22K
- 10UF | +
- C49 | T_J_ROUT
- R91
- 560PF | U5.A
- 1K
- TL074
- R31 | 39K | R37
- 510R | TL074
- GND | GND
- R87
- 100K
- E | E
- C54
- 560PF
- R93 | 100K
- GND | GND | cell
- GND | 17/10/2019
- Sheet: | 3/5
- 1 | 2 | 3 | 4 | 5 | 6 | 7 | 8

## Sheet 4 of 5: Sheet4
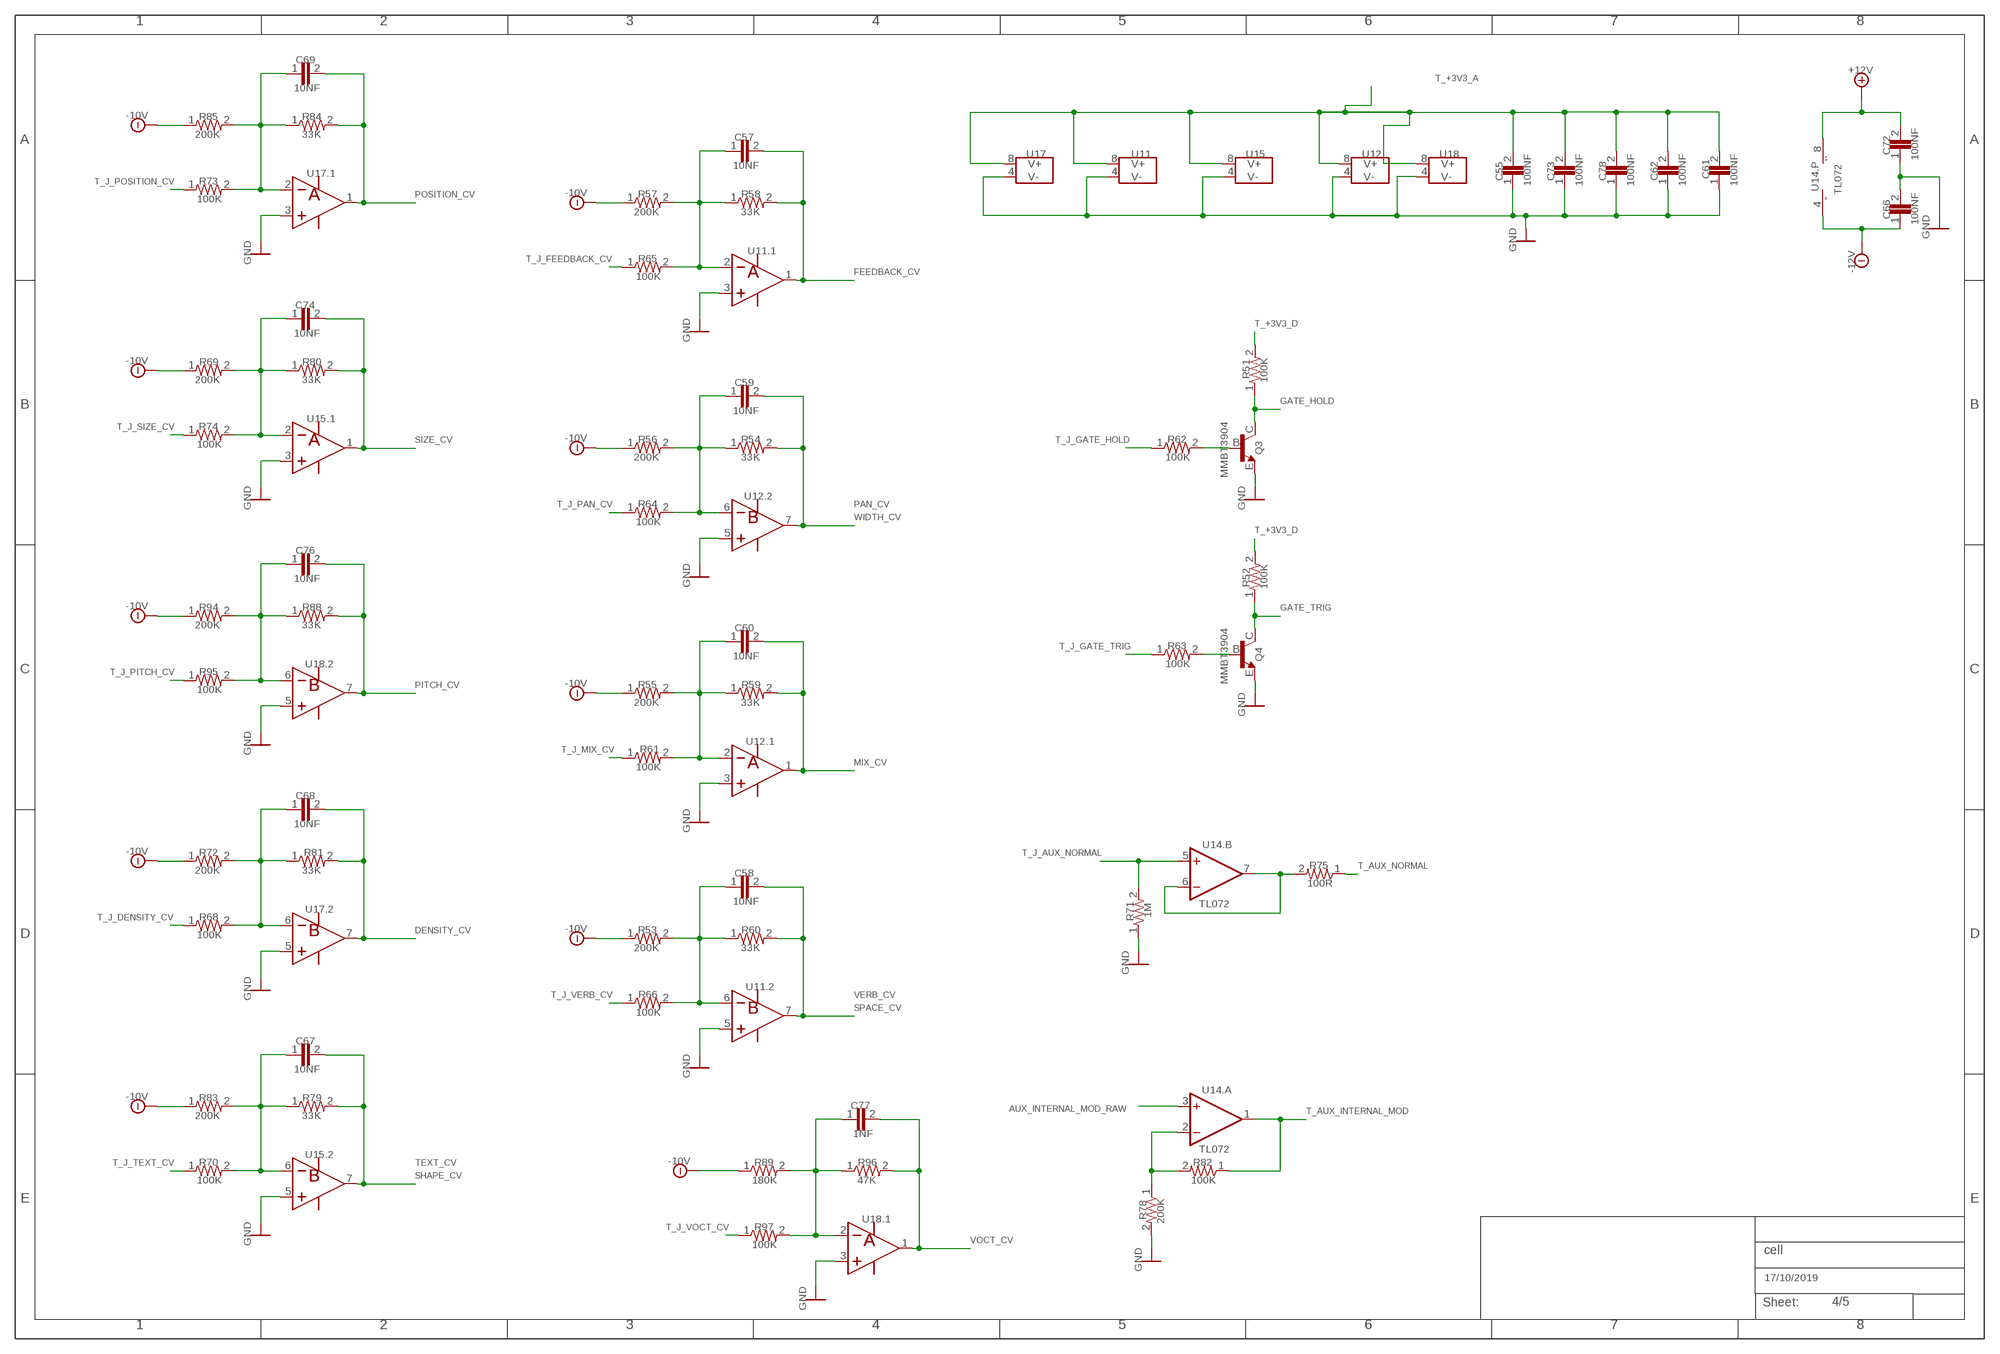
[diagram p3: schematic, sheet 4]

### Parts
C55  100NF  C-EUC0603_(C-EU)  [CAP_0603]
C57  10NF  C-EUC0603_(C-EU)  [CAP_0603]
C58  10NF  C-EUC0603_(C-EU)  [CAP_0603]
C59  10NF  C-EUC0603_(C-EU)  [CAP_0603]
C60  10NF  C-EUC0603_(C-EU)  [CAP_0603]
C61  100NF  C-EUC0603_(C-EU)  [CAP_0603]
C62  100NF  C-EUC0603_(C-EU)  [CAP_0603]
C66  100NF  C-EUC0603_(C-EU)  [CAP_0603]
C67  10NF  C-EUC0603_(C-EU)  [CAP_0603]
C68  10NF  C-EUC0603_(C-EU)  [CAP_0603]
C69  10NF  C-EUC0603_(C-EU)  [CAP_0603]
C72  100NF  C-EUC0603_(C-EU)  [CAP_0603]
C73  100NF  C-EUC0603_(C-EU)  [CAP_0603]
C74  10NF  C-EUC0603_(C-EU)  [CAP_0603]
C76  10NF  C-EUC0603_(C-EU)  [CAP_0603]
C77  1NF  C-EUC0603_(C-EU)  [CAP_0603]
C78  100NF  C-EUC0603_(C-EU)  [CAP_0603]
Q3  MMBT3904  -NPN-MMBT3904LT1SOT23-BEC_(-NPN-)  [SOT23-BEC]
Q4  MMBT3904  -NPN-MMBT3904LT1SOT23-BEC_(-NPN-)  [SOT23-BEC]
R51  100K  R-US_R0603_(R-US_)  [RES_0603]
R52  100K  R-US_R0603_(R-US_)  [RES_0603]
R53  200K  R-US_R0603_(R-US_)  [RES_0603]
R54  33K  R-US_R0603_(R-US_)  [RES_0603]
R55  200K  R-US_R0603_(R-US_)  [RES_0603]
R56  200K  R-US_R0603_(R-US_)  [RES_0603]
R57  200K  R-US_R0603_(R-US_)  [RES_0603]
R58  33K  R-US_R0603_(R-US_)  [RES_0603]
R59  33K  R-US_R0603_(R-US_)  [RES_0603]
R60  33K  R-US_R0603_(R-US_)  [RES_0603]
R61  100K  R-US_R0603_(R-US_)  [RES_0603]
R62  100K  R-US_R0603_(R-US_)  [RES_0603]
R63  100K  R-US_R0603_(R-US_)  [RES_0603]
R64  100K  R-US_R0603_(R-US_)  [RES_0603]
R65  100K  R-US_R0603_(R-US_)  [RES_0603]
R66  100K  R-US_R0603_(R-US_)  [RES_0603]
R68  100K  R-US_R0603_(R-US_)  [RES_0603]
R69  200K  R-US_R0603_(R-US_)  [RES_0603]
R70  100K  R-US_R0603_(R-US_)  [RES_0603]
R71  1M  R-US_R0603_(R-US_)  [RES_0603]
R72  200K  R-US_R0603_(R-US_)  [RES_0603]
R73  100K  R-US_R0603_(R-US_)  [RES_0603]
R74  100K  R-US_R0603_(R-US_)  [RES_0603]
R75  100R  R-US_R0603_(R-US_)  [RES_0603]
R78  200K  R-US_R0603_(R-US_)  [RES_0603]
R79  33K  R-US_R0603_(R-US_)  [RES_0603]
R80  33K  R-US_R0603_(R-US_)  [RES_0603]
R81  33K  R-US_R0603_(R-US_)  [RES_0603]
R82  100K  R-US_R0603_(R-US_)  [RES_0603]
R83  200K  R-US_R0603_(R-US_)  [RES_0603]
R84  33K  R-US_R0603_(R-US_)  [RES_0603]
R85  200K  R-US_R0603_(R-US_)  [RES_0603]
R88  33K  R-US_R0603_(R-US_)  [RES_0603]
R89  180K  R-US_R0603_(R-US_)  [RES_0603]
R94  200K  R-US_R0603_(R-US_)  [RES_0603]
R95  100K  R-US_R0603_(R-US_)  [RES_0603]
R96  47K  R-US_R0603_(R-US_)  [RES_0603]
R97  100K  R-US_R0603_(R-US_)  [RES_0603]
U11  MCP6002  [SOIC-8/150MIL]
U12  MCP6002  [SOIC-8/150MIL]
U14  TL072  TL072_SO-8_(TL072)  [SO-8]
U15  MCP6002  [SOIC-8/150MIL]
U17  MCP6002  [SOIC-8/150MIL]
U18  MCP6002  [SOIC-8/150MIL]

### Nets
+12V [power]: C72.2 U14.8(PART_P:V+) ; also sheet 1,2,3
-10V: R53.1 R55.1 R56.1 R57.1 R69.1 R72.1 R83.1 R85.1 R89.1 R94.1 ; also sheet 2
-12V [power]: C66.1 U14.4(PART_P:V-) ; also sheet 1,2,3
AUX_INTERNAL_MOD_RAW: U14.3(PART_A:+IN) ; also sheet 5
DENSITY_CV: C68.2 R81.2 U17.7(PART_2:OUT) ; also sheet 5
FEEDBACK_CV: C57.2 R58.2 U11.1(PART_1:OUT) ; also sheet 5
GATE_HOLD: Q3.C R51.1 ; also sheet 5
GATE_TRIG: Q4.C R52.1 ; also sheet 5
GND: C55.1 C61.1 C62.1 C66.2 C72.1 C73.1 C78.1 Q3.E Q4.E R71.1 R78.2 U11.3(PART_1:IN+) U11.4(VCC_AND_GND:V-) U11.5(PART_2:IN+) U12.3(PART_1:IN+) U12.4(VCC_AND_GND:V-) U12.5(PART_2:IN+) U15.3(PART_1:IN+) U15.4(VCC_AND_GND:V-) U15.5(PART_2:IN+) U17.3(PART_1:IN+) U17.4(VCC_AND_GND:V-) U17.5(PART_2:IN+) U18.3(PART_1:IN+) U18.4(VCC_AND_GND:V-) U18.5(PART_2:IN+) ; supply symbol labelled GND_7 ; also sheet 1,2,3,5
MIX_CV: C60.2 R59.2 U12.1(PART_1:OUT) ; also sheet 5
N$5: C74.1 R69.2 R74.2 R80.1 U15.2(PART_1:IN-)
N$11: C76.1 R88.1 R94.2 R95.2 U18.6(PART_2:IN-)
N$16: C68.1 R68.2 R72.2 R81.1 U17.6(PART_2:IN-)
N$21: C57.1 R57.2 R58.1 R65.2 U11.2(PART_1:IN-)
N$26: C59.1 R54.1 R56.2 R64.2 U12.6(PART_2:IN-)
N$31: C60.1 R55.2 R59.1 R61.2 U12.2(PART_1:IN-)
N$36: C58.1 R53.2 R60.1 R66.2 U11.6(PART_2:IN-)
N$41: C67.1 R70.2 R79.1 R83.2 U15.6(PART_2:IN-)
N$46: R75.2 U14.6(PART_B:-IN) U14.7(PART_B:OUT)
N$47: Q3.B R62.2
N$49: C77.1 R89.2 R96.1 R97.2 U18.2(PART_1:IN-)
N$52: Q4.B R63.2
N$82: C69.1 R73.2 R84.1 R85.2 U17.2(PART_1:IN-)
N$116: R78.1 R82.2 U14.2(PART_A:-IN)
PITCH_CV: C76.2 R88.2 U18.7(PART_2:OUT) ; also sheet 5
POSITION_CV: C69.2 R84.2 U17.1(PART_1:OUT) ; also sheet 5
SHAPE_CV: C67.2 R79.2 U15.7(PART_2:OUT) ; also sheet 5
SIZE_CV: C74.2 R80.2 U15.1(PART_1:OUT) ; also sheet 5
SPACE_CV: C58.2 R60.2 U11.7(PART_2:OUT) ; also sheet 5
T_+3V3_A [power]: C55.2 C61.2 C62.2 C73.2 C78.2 U11.8(VCC_AND_GND:V+) U12.8(VCC_AND_GND:V+) U15.8(VCC_AND_GND:V+) U17.8(VCC_AND_GND:V+) U18.8(VCC_AND_GND:V+) ; also sheet 1,2,5
T_+3V3_D [power]: R51.2 R52.2 ; also sheet 1,2,5
T_AUX_INTERNAL_MOD: R82.1 U14.1(PART_A:OUT) ; also sheet 1
T_AUX_NORMAL: R75.1 ; also sheet 1
T_J_AUX_NORMAL: R71.2 U14.5(PART_B:+IN) ; also sheet 1
T_J_DENSITY_CV: R68.1 ; also sheet 1
T_J_FEEDBACK_CV: R65.1 ; also sheet 1
T_J_GATE_HOLD: R62.1 ; also sheet 1
T_J_GATE_TRIG: R63.1 ; also sheet 1
T_J_MIX_CV: R61.1 ; also sheet 1
T_J_PAN_CV: R64.1 ; also sheet 1
T_J_PITCH_CV: R95.1 ; also sheet 1
T_J_POSITION_CV: R73.1 ; also sheet 1
T_J_SIZE_CV: R74.1 ; also sheet 1
T_J_TEXT_CV: R70.1 ; also sheet 1
T_J_VERB_CV: R66.1 ; also sheet 1
T_J_VOCT_CV: R97.1 ; also sheet 1
VOCT_CV: C77.2 R96.2 U18.1(PART_1:OUT) ; also sheet 5
WIDTH_CV: C59.2 R54.2 U12.7(PART_2:OUT) ; also sheet 5

### Notes on the sheet
- 1 | 2 | 3 | 4 | 5 | 6 | 7 | 8
- C69
- T_+3V3_A | +12V
- 10NF
- -10V | R85 | R84
- 200K | 33K
- A | A
- C57
- U17 | U11 | U15 | U12 | U18 | C72
- 10NF | V+ | 100NF
- T_J_POSITION_CV | U17.1 | C61
- C55 | C73 | C78 | C62
- R73 | 100NF | 100NF | 100NF | 100NF | 100NF
- A
- POSITION_CV | U14.P
- 100K | -10V | R57 | R58 | TL072
- V-
- 200K | 33K
- C66
- 100NF
- GND
- U11.1 | GND
- T_J_FEEDBACK_CV
- GND | R65
- A
- FEEDBACK_CV
- 100K | -12V
- C74
- T_+3V3_D
- 10NF
- GND
- -10V | R69 | R80
- 200K | 33K
- R51
- 100K
- C59
- B | GATE_HOLD | B
- 10NF
- T_J_SIZE_CV | U15.1
- R74
- A
- SIZE_CV | T_J_GATE_HOLD
- 100K | -10V | R56 | R54 | R62
- 200K | 33K | 100K | Q3
- MMBT3904
- T_J_PAN_CV | U12.2 | PAN_CV
- GND | R64 | GND
- B
- WIDTH_CV
- 100K
- T_+3V3_D
- C76
- 10NF
- GND | R52 | 100K
- GATE_TRIG
- -10V | R94 | R88
- 200K | 33K
- C60
- T_J_GATE_TRIG
- 10NF | R63
- 100K | Q4
- C | C
- T_J_PITCH_CV | U18.2
- R95
- B
- PITCH_CV | MMBT3904
- 100K | -10V | R55 | R59
- 200K | 33K
- GND
- T_J_MIX_CV | U12.1
- GND | R61
- A
- MIX_CV
- 100K
- C68
- 10NF
- GND
- T_J_AUX_NORMAL | U14.B
- -10V | R72 | R81
- T_AUX_NORMAL
- 200K | 33K | R75
- C58 | 100R
- 10NF | TL072
- T_J_DENSITY_CV | U17.2
- R68 | 1M
- B | R71
- D | DENSITY_CV | D
- 100K | -10V | R53 | R60
- 200K | 33K
- GND
- T_J_VERB_CV | U11.2 | VERB_CV
- GND | R66
- B
- SPACE_CV
- 100K
- C67
- 10NF
- GND
- U14.A
- -10V | R83 | R79
- AUX_INTERNAL_MOD_RAW | T_AUX_INTERNAL_MOD
- 200K | 33K | C77
- 1NF
- TL072
- T_J_TEXT_CV | U15.2 | TEXT_CV
- R70 | -10V | R89 | R96 | R82
- B
- SHAPE_CV
- 100K | 180K | 47K | 100K
- E | E
- U18.1 | R78
- T_J_VOCT_CV | 200K
- R97
- A
- VOCT_CV
- 100K
- GND | cell
- GND | 17/10/2019
- Sheet: | 4/5
- GND
- 1 | 2 | 3 | 4 | 5 | 6 | 7 | 8

## Sheet 5 of 5: Sheet5
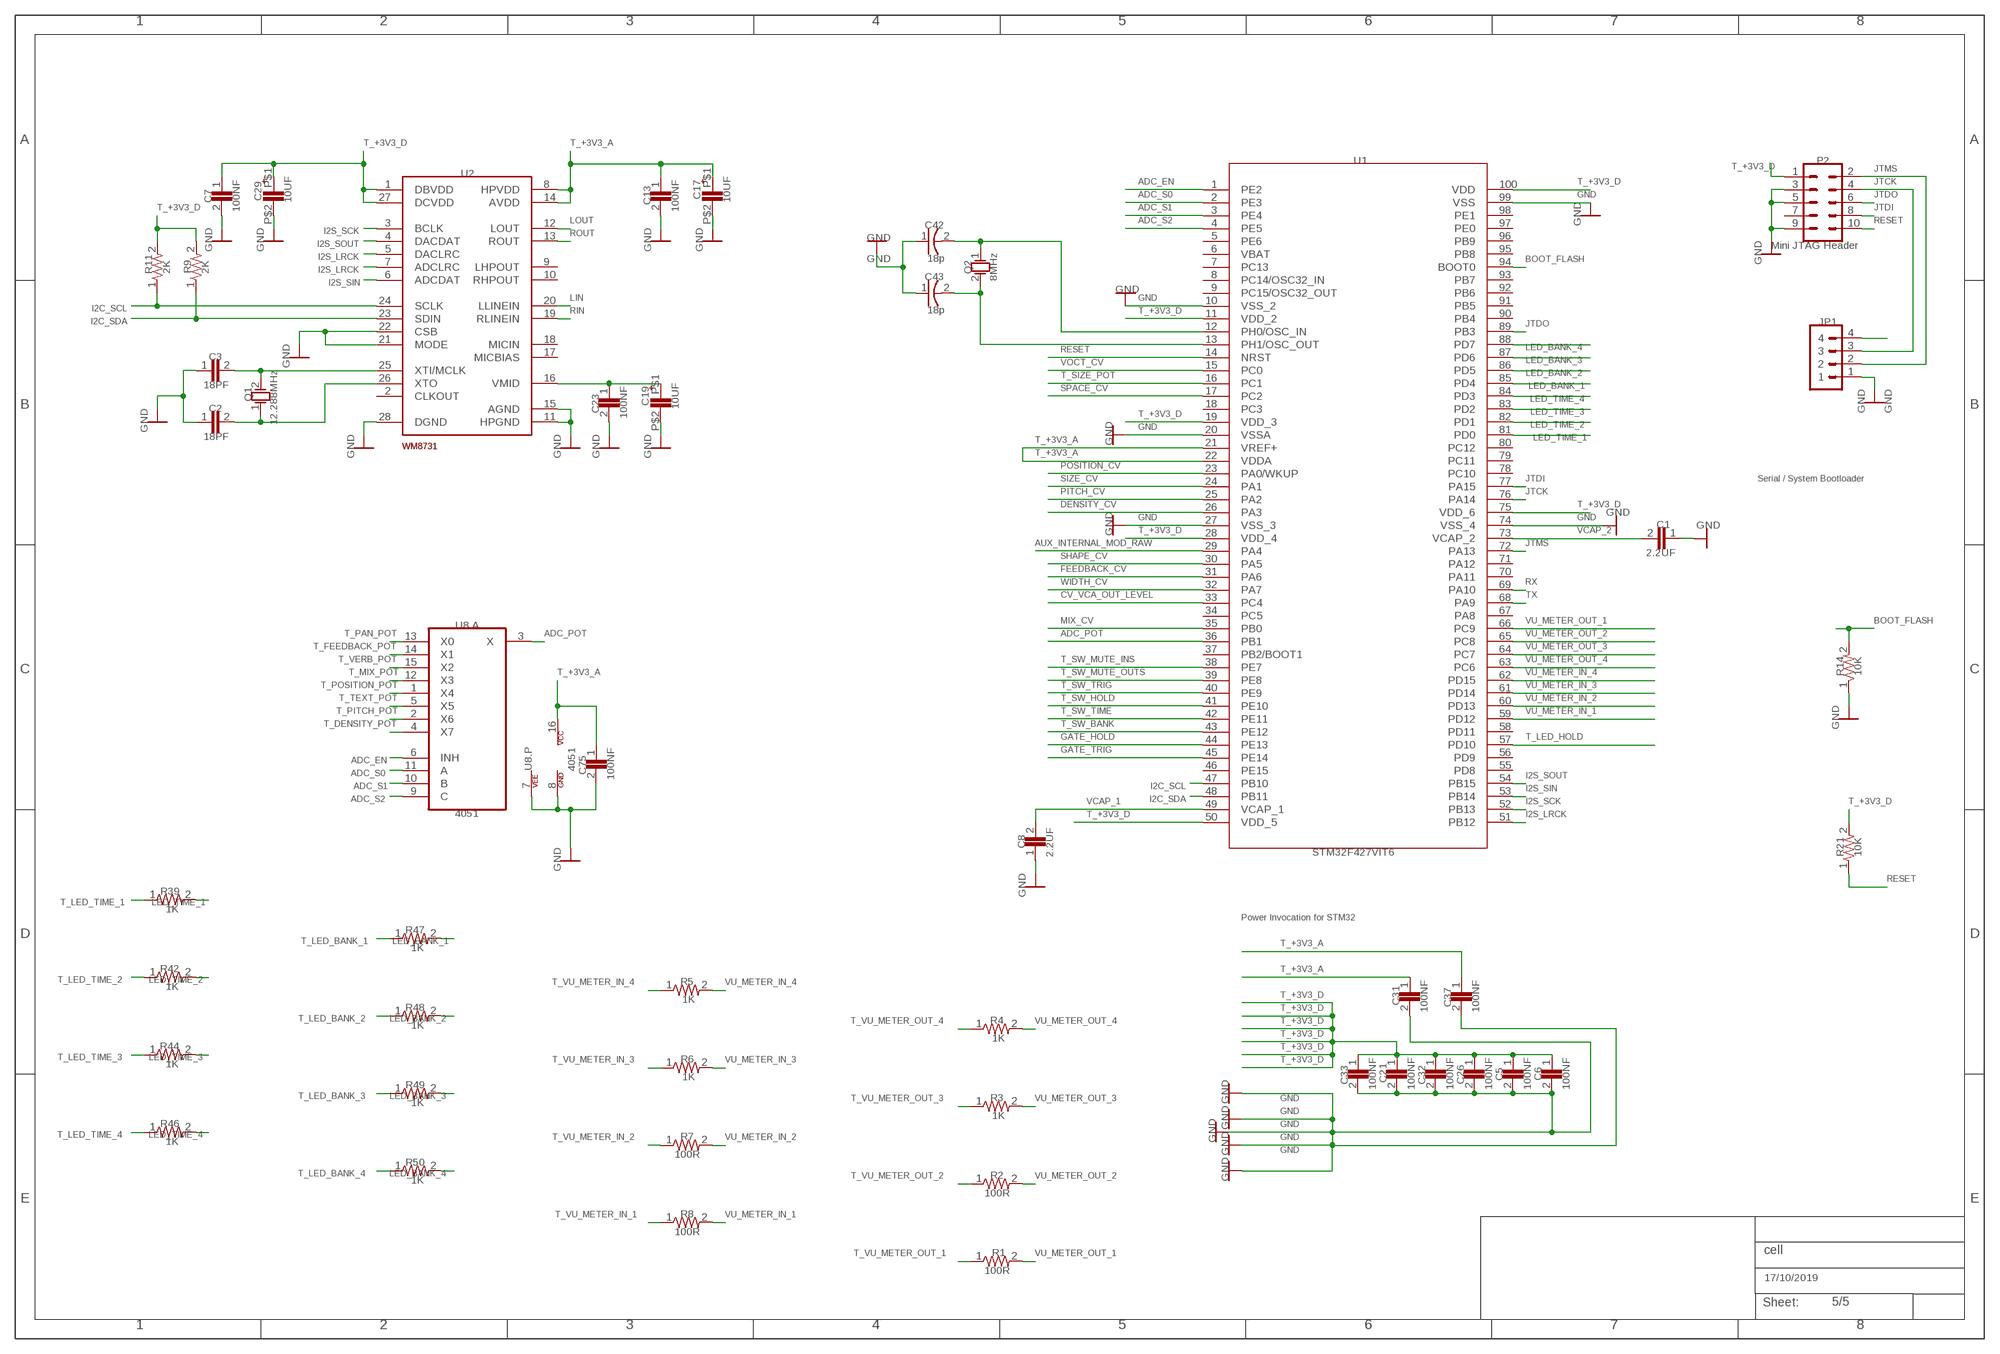
[diagram p4: schematic, sheet 5]

### Parts
C1  2.2UF  C-EUC0603_(C-EU)  [CAP_0603]
C2  18PF  C-EUC0603_(C-EU)  [CAP_0603]
C3  18PF  C-EUC0603_(C-EU)  [CAP_0603]
C5  100NF  C-EUC0603_(C-EU)  [CAP_0603]
C6  100NF  C-EUC0603_(C-EU)  [CAP_0603]
C7  100NF  C-EUC0603_(C-EU)  [CAP_0603]
C8  2.2UF  C-EUC0603_(C-EU)  [CAP_0603]
C13  100NF  C-EUC0603_(C-EU)  [CAP_0603]
C17  10UF  C-EU-POL_4D_(C-EU-POL)  [EC-4X7]
C19  10UF  C-EU-POL_4D_(C-EU-POL)  [EC-4X7]
C21  100NF  C-EUC0603_(C-EU)  [CAP_0603]
C23  100NF  C-EUC0603_(C-EU)  [CAP_0603]
C26  100NF  C-EUC0603_(C-EU)  [CAP_0603]
C29  10UF  C-EU-POL_4D_(C-EU-POL)  [EC-4X7]
C31  100NF  C-EUC0603_(C-EU)  [CAP_0603]
C32  100NF  C-EUC0603_(C-EU)  [CAP_0603]
C33  100NF  C-EUC0603_(C-EU)  [CAP_0603]
C37  100NF  C-EUC0603_(C-EU)  [CAP_0603]
C42  18p  C-USC0603  [CAP_0603]
C43  18p  C-USC0603  [CAP_0603]
C75  100NF  C-EUC0603_(C-EU)  [CAP_0603]
JP1  M04PTH  [1X04]
P2  Mini JTAG Header  M05X2MINIJTAG_(M05X2)  [2X5-1.27]
Q1  12.288MHz  TXC_7A_CRYSTAL  [TSC_7A_CRYSTAL]
Q2  8MHz  TXC_7A_CRYSTAL  [TSC_7A_CRYSTAL]
R1  100R  R-US_R0603_(R-US_)  [RES_0603]
R2  100R  R-US_R0603_(R-US_)  [RES_0603]
R3  1K  R-US_R0603_(R-US_)  [RES_0603]
R4  1K  R-US_R0603_(R-US_)  [RES_0603]
R5  1K  R-US_R0603_(R-US_)  [RES_0603]
R6  1K  R-US_R0603_(R-US_)  [RES_0603]
R7  100R  R-US_R0603_(R-US_)  [RES_0603]
R8  100R  R-US_R0603_(R-US_)  [RES_0603]
R9  2K  R-US_R0603_(R-US_)  [RES_0603]
R11  2K  R-US_R0603_(R-US_)  [RES_0603]
R14  10K  R-US_R0603_(R-US_)_21  [RES_0603]
R21  10K  R-US_R0603_(R-US_)  [RES_0603]
R39  1K  R-US_R0603_(R-US_)  [RES_0603]
R42  1K  R-US_R0603_(R-US_)  [RES_0603]
R44  1K  R-US_R0603_(R-US_)  [RES_0603]
R46  1K  R-US_R0603_(R-US_)  [RES_0603]
R47  1K  R-US_R0603_(R-US_)  [RES_0603]
R48  1K  R-US_R0603_(R-US_)  [RES_0603]
R49  1K  R-US_R0603_(R-US_)  [RES_0603]
R50  1K  R-US_R0603_(R-US_)  [RES_0603]
U1  STM32F427VIT6  STM32F4XXV2  [LQFP100-14X14MM]
U2  WM8731  [SSOP-28]
U8  4051  4051_MUX  [SO-16]

### Nets
ADC_EN: U1.1(PE2) U8.6(PART_A:INH)
ADC_POT: U1.36(PB1) U8.3(PART_A:X)
ADC_S0: U1.2(PE3) U8.11(PART_A:A)
ADC_S1: U1.3(PE4) U8.10(PART_A:B)
ADC_S2: U1.4(PE5) U8.9(PART_A:C)
AUX_INTERNAL_MOD_RAW: U1.29(PA4) ; also sheet 4
BOOT_FLASH: R14.2 U1.94(BOOT0)
CV_VCA_OUT_LEVEL: U1.33(PC4) ; also sheet 3
DENSITY_CV: U1.26(PA3) ; also sheet 4
FEEDBACK_CV: U1.31(PA6) ; also sheet 4
GATE_HOLD: U1.44(PE13) ; also sheet 4
GATE_TRIG: U1.45(PE14) ; also sheet 4
GND: C1.1 C2.1 C3.1 C5.2 C6.2 C7.2 C8.1 C13.2 C17.P$2(NEG) C19.P$2(NEG) C21.2 C23.2 C26.2 C29.P$2(NEG) C31.2 C32.2 C33.2 C37.2 C42.1 C43.1 C75.2 JP1.1 P2.3 P2.5 P2.9 R14.1 U1.10(VSS_2) U1.20(VSSA) U1.27(VSS_3) U1.74(VSS_4) U1.99(VSS) U2.11(HPGND) U2.15(AGND) U2.21(MODE) U2.22(CSB) U2.28(DGND) U8.7(PART_P:VEE) U8.8(PART_P:GND) ; supply symbol labelled GND_7 ; also sheet 1,2,3,4
I2C_SCL: R11.1 U1.47(PB10) U2.24(SCLK)
I2C_SDA: R9.1 U1.48(PB11) U2.23(SDIN)
I2S_LRCK: U1.51(PB12) U2.5(DACLRC) U2.7(ADCLRC)
I2S_SCK: U1.52(PB13) U2.3(BCLK)
I2S_SIN: U1.53(PB14) U2.6(ADCDAT)
I2S_SOUT: U1.54(PB15) U2.4(DACDAT)
JTCK: JP1.3 P2.4 U1.76(PA14)
JTDI: P2.8 U1.77(PA15)
JTDO: P2.6 U1.89(PB3)
JTMS: JP1.2 P2.2 U1.72(PA13)
LED_BANK_1: R47.2 U1.85(PD4)
LED_BANK_2: R48.2 U1.86(PD5)
LED_BANK_3: R49.2 U1.87(PD6)
LED_BANK_4: R50.2 U1.88(PD7)
LED_TIME_1: R39.2 U1.81(PD0)
LED_TIME_2: R42.2 U1.82(PD1)
LED_TIME_3: R44.2 U1.83(PD2)
LED_TIME_4: R46.2 U1.84(PD3)
LIN: U2.20(LLINEIN) ; also sheet 3
LOUT: U2.12(LOUT) ; also sheet 3
MIX_CV: U1.35(PB0) ; also sheet 4
N$4: C19.P$1(POS) C23.1 U2.16(VMID)
N$59: C2.2 Q1.1(OSC1) U2.26(XTO)
N$60: C3.2 Q1.2(OSC2) U2.25(XTI/MCLK)
N$112: C42.2 Q2.1(OSC1) U1.12(PH0/OSC_IN)
Net_84: C43.2 Q2.2(OSC2) U1.13(PH1/OSC_OUT)
PITCH_CV: U1.25(PA2) ; also sheet 4
POSITION_CV: U1.23(PA0/WKUP) ; also sheet 4
RESET: JP1.4 P2.10 R21.1 U1.14(NRST)
RIN: U2.19(RLINEIN) ; also sheet 3
ROUT: U2.13(ROUT) ; also sheet 3
RX: U1.69(PA10)
SHAPE_CV: U1.30(PA5) ; also sheet 4
SIZE_CV: U1.24(PA1) ; also sheet 4
SPACE_CV: U1.17(PC2) ; also sheet 4
T_+3V3_A [power]: C13.1 C17.P$1(POS) C31.1 C37.1 C75.1 U1.21(VREF+) U1.22(VDDA) U2.8(HPVDD) U2.14(AVDD) U8.16(PART_P:VCC) ; also sheet 1,2,4
T_+3V3_D [power]: C5.1 C6.1 C7.1 C21.1 C26.1 C29.P$1(POS) C32.1 C33.1 P2.1 R9.2 R11.2 R21.2 U1.11(VDD_2) U1.19(VDD_3) U1.28(VDD_4) U1.50(VDD_5) U1.75(VDD_6) U1.100(VDD) U2.1(DBVDD) U2.27(DCVDD) ; also sheet 1,2,4
T_DENSITY_POT: U8.4(PART_A:X7) ; also sheet 1
T_FEEDBACK_POT: U8.14(PART_A:X1) ; also sheet 1
T_LED_BANK_1: R47.1 ; also sheet 1
T_LED_BANK_2: R48.1 ; also sheet 1
T_LED_BANK_3: R49.1 ; also sheet 1
T_LED_BANK_4: R50.1 ; also sheet 1
T_LED_HOLD: U1.57(PD10) ; also sheet 1
T_LED_TIME_1: R39.1 ; also sheet 1
T_LED_TIME_2: R42.1 ; also sheet 1
T_LED_TIME_3: R44.1 ; also sheet 1
T_LED_TIME_4: R46.1 ; also sheet 1
T_MIX_POT: U8.12(PART_A:X3) ; also sheet 1
T_PAN_POT: U8.13(PART_A:X0) ; also sheet 1
T_PITCH_POT: U8.2(PART_A:X6) ; also sheet 1
T_POSITION_POT: U8.1(PART_A:X4) ; also sheet 1
T_SIZE_POT: U1.16(PC1) ; also sheet 1
T_SW_BANK: U1.43(PE12) ; also sheet 1
T_SW_HOLD: U1.41(PE10) ; also sheet 1
T_SW_MUTE_INS: U1.38(PE7) ; also sheet 1
T_SW_MUTE_OUTS: U1.39(PE8) ; also sheet 1
T_SW_TIME [power]: U1.42(PE11) ; also sheet 1
T_SW_TRIG: U1.40(PE9) ; also sheet 1
T_TEXT_POT: U8.5(PART_A:X5) ; also sheet 1
T_VERB_POT: U8.15(PART_A:X2) ; also sheet 1
T_VU_METER_IN_1: R8.1 ; also sheet 1
T_VU_METER_IN_2: R7.1 ; also sheet 1
T_VU_METER_IN_3: R6.1 ; also sheet 1
T_VU_METER_IN_4: R5.1 ; also sheet 1
T_VU_METER_OUT_1: R1.1 ; also sheet 1
T_VU_METER_OUT_2: R2.1 ; also sheet 1
T_VU_METER_OUT_3: R3.1 ; also sheet 1
T_VU_METER_OUT_4: R4.1 ; also sheet 1
TX: U1.68(PA9)
VBAT: U1.6(VBAT)
VCAP_1: C8.2 U1.49(VCAP_1)
VCAP_2: C1.2 U1.73(VCAP_2)
VOCT_CV: U1.15(PC0) ; also sheet 4
VU_METER_IN_1: R8.2 U1.59(PD12)
VU_METER_IN_2: R7.2 U1.60(PD13)
VU_METER_IN_3: R6.2 U1.61(PD14)
VU_METER_IN_4: R5.2 U1.62(PD15)
VU_METER_OUT_1: R1.2 U1.66(PC9)
VU_METER_OUT_2: R2.2 U1.65(PC8)
VU_METER_OUT_3: R3.2 U1.64(PC7)
VU_METER_OUT_4: R4.2 U1.63(PC6)
WIDTH_CV: U1.32(PA7) ; also sheet 4
Unconnected: P2.7 U1.5(PE6) U1.7(PC13) U1.8(PC14/OSC32_IN) U1.9(PC15/OSC32_OUT) U1.18(PC3) U1.34(PC5) U1.37(PB2/BOOT1) U1.46(PE15) U1.55(PD8) U1.56(PD9) U1.58(PD11) U1.67(PA8) U1.70(PA11) U1.71(PA12) U1.78(PC10) U1.79(PC11) U1.80(PC12) U1.90(PB4) U1.91(PB5) U1.92(PB6) U1.93(PB7) U1.95(PB8) U1.96(PB9) U1.97(PE0) U1.98(PE1) U2.2(CLKOUT) U2.9(LHPOUT) U2.10(RHPOUT) U2.17(MICBIAS) U2.18(MICIN)

### Notes on the sheet
- 1 | 2 | 3 | 4 | 5 | 6 | 7 | 8
- A | A
- T_+3V3_D | T_+3V3_A
- U1 | T_+3V3_D | P2 | JTMS
- + | U2 | + | ADC_EN | T_+3V3_D | JTCK
- ADC_S0 | GND | JTDO
- C29 | C17
- T_+3V3_D | C7 | 10UF | C13 | 10UF | ADC_S1 | JTDI
- 100NF | 100NF
- LOUT | ADC_S2 | RESET
- I2S_SCK | C42 | GND
- ROUT
- I2S_SOUT | GND | Mini JTAG Header
- GND | GND | I2S_LRCK | GND | GND | GND | 18p
- BOOT_FLASH
- I2S_LRCK | GND
- R11 | 2K | R9 | 2K | Q2
- I2S_SIN | C43 | 8MHz
- LIN | GND | GND
- I2C_SCL | RIN | 18p | T_+3V3_D
- I2C_SDA | JTDO
- JP1
- RESET | LED_BANK_4
- VOCT_CV | LED_BANK_3
- C3
- GND | LED_BANK_2
- T_SIZE_POT
- 18PF | LED_BANK_1
- + | SPACE_CV
- LED_TIME_4
- B | Q1 | B
- C19
- 10UF | T_+3V3_D | LED_TIME_3
- C2 | C23 | GND | GND
- 100NF
- GND | LED_TIME_2
- 12.288MHz
- GND | 18PF | LED_TIME_1
- T_+3V3_A
- WM8731 | GND
- T_+3V3_A
- GND | GND | GND | GND
- POSITION_CV
- SIZE_CV | JTDI | Serial / System Bootloader
- PITCH_CV | JTCK
- DENSITY_CV | T_+3V3_D
- GND | GND | GND
- T_+3V3_D | VCAP_2 | C1 | GND
- GND
- AUX_INTERNAL_MOD_RAW | JTMS
- 2.2UF
- SHAPE_CV
- FEEDBACK_CV
- WIDTH_CV | RX
- CV_VCA_OUT_LEVEL | TX
- MIX_CV | VU_METER_OUT_1 | BOOT_FLASH
- T_PAN_POT | U8.A | ADC_POT | ADC_POT | VU_METER_OUT_2
- T_FEEDBACK_POT | VU_METER_OUT_3
- T_VERB_POT | T_SW_MUTE_INS | VU_METER_OUT_4
- C | C
- T_MIX_POT | T_+3V3_A | T_SW_MUTE_OUTS | VU_METER_IN_4
- R14 | 10K
- T_POSITION_POT | T_SW_TRIG | VU_METER_IN_3
- T_TEXT_POT | T_SW_HOLD | VU_METER_IN_2
- T_PITCH_POT | T_SW_TIME | VU_METER_IN_1
- T_DENSITY_POT | T_SW_BANK
- GND
- GATE_HOLD | T_LED_HOLD
- VCC | GATE_TRIG
- ADC_EN
- ADC_S0 | U8.P | 4051 | I2S_SOUT
- C75
- 100NF
- ADC_S1 | I2C_SCL | I2S_SIN
- VEE | GND
- ADC_S2 | VCAP_1 | I2C_SDA | I2S_SCK | T_+3V3_D
- 4051 | T_+3V3_D | I2S_LRCK
- C8 | STM32F427VIT6
- 2.2UF | R21 | 10K
- GND
- RESET
- R39 | GND
- T_LED_TIME_1 | LED_TIME_1
- 1K
- Power Invocation for STM32
- D | D
- R47
- T_LED_BANK_1 | LED_BANK_1 | T_+3V3_A
- 1K
- T_+3V3_A
- R42
- T_LED_TIME_2 | LED_TIME_2 | T_VU_METER_IN_4 | VU_METER_IN_4
- 1K | R5
- T_+3V3_D
- 1K
- T_+3V3_D | C31 | C37
- R48 | 100NF | 100NF
- T_LED_BANK_2 | LED_BANK_2 | T_VU_METER_OUT_4 | VU_METER_OUT_4 | T_+3V3_D
- 1K | R4
- T_+3V3_D
- 1K
- T_+3V3_D
- R44
- T_LED_TIME_3 | LED_TIME_3 | T_VU_METER_IN_3 | VU_METER_IN_3 | T_+3V3_D
- 1K | R6
- 1K
- C21 | C5 | C6
- C33 | C32 | C26
- R49 | 100NF | 100NF | 100NF | 100NF | 100NF | 100NF
- T_LED_BANK_3 | LED_BANK_3 | T_VU_METER_OUT_3 | VU_METER_OUT_3 | GND
- 1K | R3
- GND
- GND
- 1K
- GND
- R46 | GND
- T_LED_TIME_4 | LED_TIME_4 | T_VU_METER_IN_2 | VU_METER_IN_2 | GND
- 1K | R7
- GND
- GND
- 100R
- GND
- R50
- T_LED_BANK_4 | LED_BANK_4 | T_VU_METER_OUT_2 | VU_METER_OUT_2
- 1K | R2
- GND
- 100R
- E | E
- T_VU_METER_IN_1 | VU_METER_IN_1
- R8
- 100R
- cell
- T_VU_METER_OUT_1 | VU_METER_OUT_1
- R1
- 100R
- 17/10/2019
- Sheet: | 5/5
- 1 | 2 | 3 | 4 | 5 | 6 | 7 | 8

## Library data of the parts
C1 C8 = common:C-EUC0603_(C-EU); PACKAGE: C0603
C2 C3 C5-C7 C9-C16 C18 C21-C26 C31-C34 C37-C41 C44-C49 C51-C78 = common:C-EUC0603_(C-EU); PACKAGE: C0603; VALUE: 2.2UF
C4 C17 C19 C20 C28-C30 = common:C-EU-POL_4D_(C-EU-POL)
C27 C35 C36 C50 = common:C-EUC0805_(C-EU); PACKAGE: C0805
C42 C43 = common:C-USC0603
D1 = common:MB1S
FB1 FB2 = common:FERRITE_BEAD_0603_(FERRITE_BEAD); BIN#: 8-047; IPN: FB R0603; MPN: MI0603J601R-10; PACKAGE: R0603
J_AUX J_HOLD J_TRIG = common:EURO_JACKS_SMALL_SILK_(EURO_JACK)
J_DENS J_FDBK J_I-LVL J_LIN J_LOUT J_MIX J_O-LVL J_PAN J_PITCH J_POSI J_RIN J_ROUT J_SIZE J_TEXT J_VERB J_VOCT = common:EURO_JACKS_SILK_(EURO_JACK)
JP1 = common:M04PTH
LED_A LED_B LED_C LED_D LED_IN3 LED_OUT3 LED_T1-LED_T4 = common:LED_SILK_(LED)
LED_IN1 LED_IN2 LED_IN4 LED_OUT1 LED_OUT2 LED_OUT4 = common:LED_SILK_(LED); VALUE: 3mm Yellow Diffused
P1 = common:M05X2PTH
P2 = common:M05X2MINIJTAG_(M05X2)
Q1 = common:TXC_7A_CRYSTAL; DATASHEET: http://datasheets.diptrace.com/crystals/12SMX.pdf
Q2 = common:TXC_7A_CRYSTAL; DATASHEET: http://datasheets.diptrace.com/crystals/12SMX.pdf; VALUE: 12.288MHz
Q3 Q4 = common:-NPN-MMBT3904LT1SOT23-BEC_(*-NPN-)
R1 R2 R7 R8 R75 = common:R-US_R0603_(R-US_); PACKAGE: R0603
R3-R6 R9-R13 R15-R74 R76-R97 = common:R-US_R0603_(R-US_); PACKAGE: R0603; VALUE: 100R
R14 = common:R-US_R0603_(R-US_)_21; PACKAGE: R0603
R98-R101 = common:R-US_R0402_(R-US_)
S_BANK S_MUTE_INS S_MUTE_OUTS S_TIME S_TRIG = common:TAC_SWITCHTACTILE_PTH_SILK_(TAC_SWITCH)
S_HOLD = common:LED_BUTTONLED_BUTTON_SILK_(LED_BUTTON)
U1 = common:STM32F4XXV2; IPN: empty; MANUFACTURER_PART_NUMBER: stm32f4xxv2; MPN: empty; VENDOR: STMicroelectronics
U2 = common:WM8731; BIN#: 16-001; IPN: WM8731; MPN: WM8731SEDS/RV; PACKAGE: SSOP-28
U3 = common:TL074_SO-14_(TL074); BIN#: 16-006; IPN: TL074 SO-14; MPN: TL074CDR; PACKAGE: SO-14
U4 U10 = common:LD1117-3V3_(LD1117); BIN#: 12-024; IPN: LD1117-3V3; MPN: LD1117S33CTR; PACKAGE: SOT-223
U5 = common:SSI2164; BIN#: 16-020; IPN: SSI2164 SO-16; MPN: SSI2164S-RT; PACKAGE: SO-16
U6 = common:LM4041DBZA12_(LM4041); MPN: LM4041A12IDBZR; OC_FARNELL: 1407949; OC_NEWARK: 58K5875
U7 = common:LM4041DBZA12_(LM4041)_14; MPN: LM4041A12IDBZR; OC_FARNELL: 1407949; OC_NEWARK: 58K5875
U8 = common:4051_MUX
U9 = common:SSI2164_40; BIN#: 16-020; IPN: SSI2164 SO-16; MPN: SSI2164S-RT; PACKAGE: SO-16
U11 U12 U15 U17 U18 = common:MCP6002; DATASHEET: http://www.ti.com/lit/gpn/tl084
U13 = common:LM4041DBZA12_(LM4041); MPN: LM4041A12IDBZR; OC_FARNELL: 1407949; OC_NEWARK: 58K5875; VALUE: LM4040-2V5
U14 = common:TL072_SO-8_(TL072); BIN#: 12-015; IPN: TL072 SO-8; MPN: TL072IDT; PACKAGE: SO-8
U16 = common:TL074_SO-14_(TL074)_4; BIN#: 16-006; IPN: TL074 SO-14; MPN: TL074CDR; PACKAGE: SO-14
U19 U20 = common:TLV2172; DATASHEET: http://datasheets.diptrace.com\ti\TL07x.pdf; MANUFACTURER: Texas Instruments
VR_DENS VR_POSI VR_SIZE VR_TEXT = common:BOURNS_PTL_LED_SLIDE_POT; DATASHEET: http://www.bourns.com/data/global/pdfs/bourns_trimpot_catalog.pdf; MANUFACTURER: Bourns
VR_FDBK VR_IN VR_MIX VR_OUT VR_PAN VR_PITCH VR_VERB = common:POT_9MM_SNAP-IN___(POT_9MM_SNAP-IN_)

## Net classes
0 default: width 0.178 mm, clearance 0.152 mm
1 power: width 0.305 mm, clearance 0.152 mm